# Altium project OpenRex_V1I1.PrjPcb (part 2 of 4)

## Sheet [05] - CPU - HDMI, LVDS.SchDoc
size A2; DocumentNumber: 5; SheetNumber: 5; SheetTotal: 31
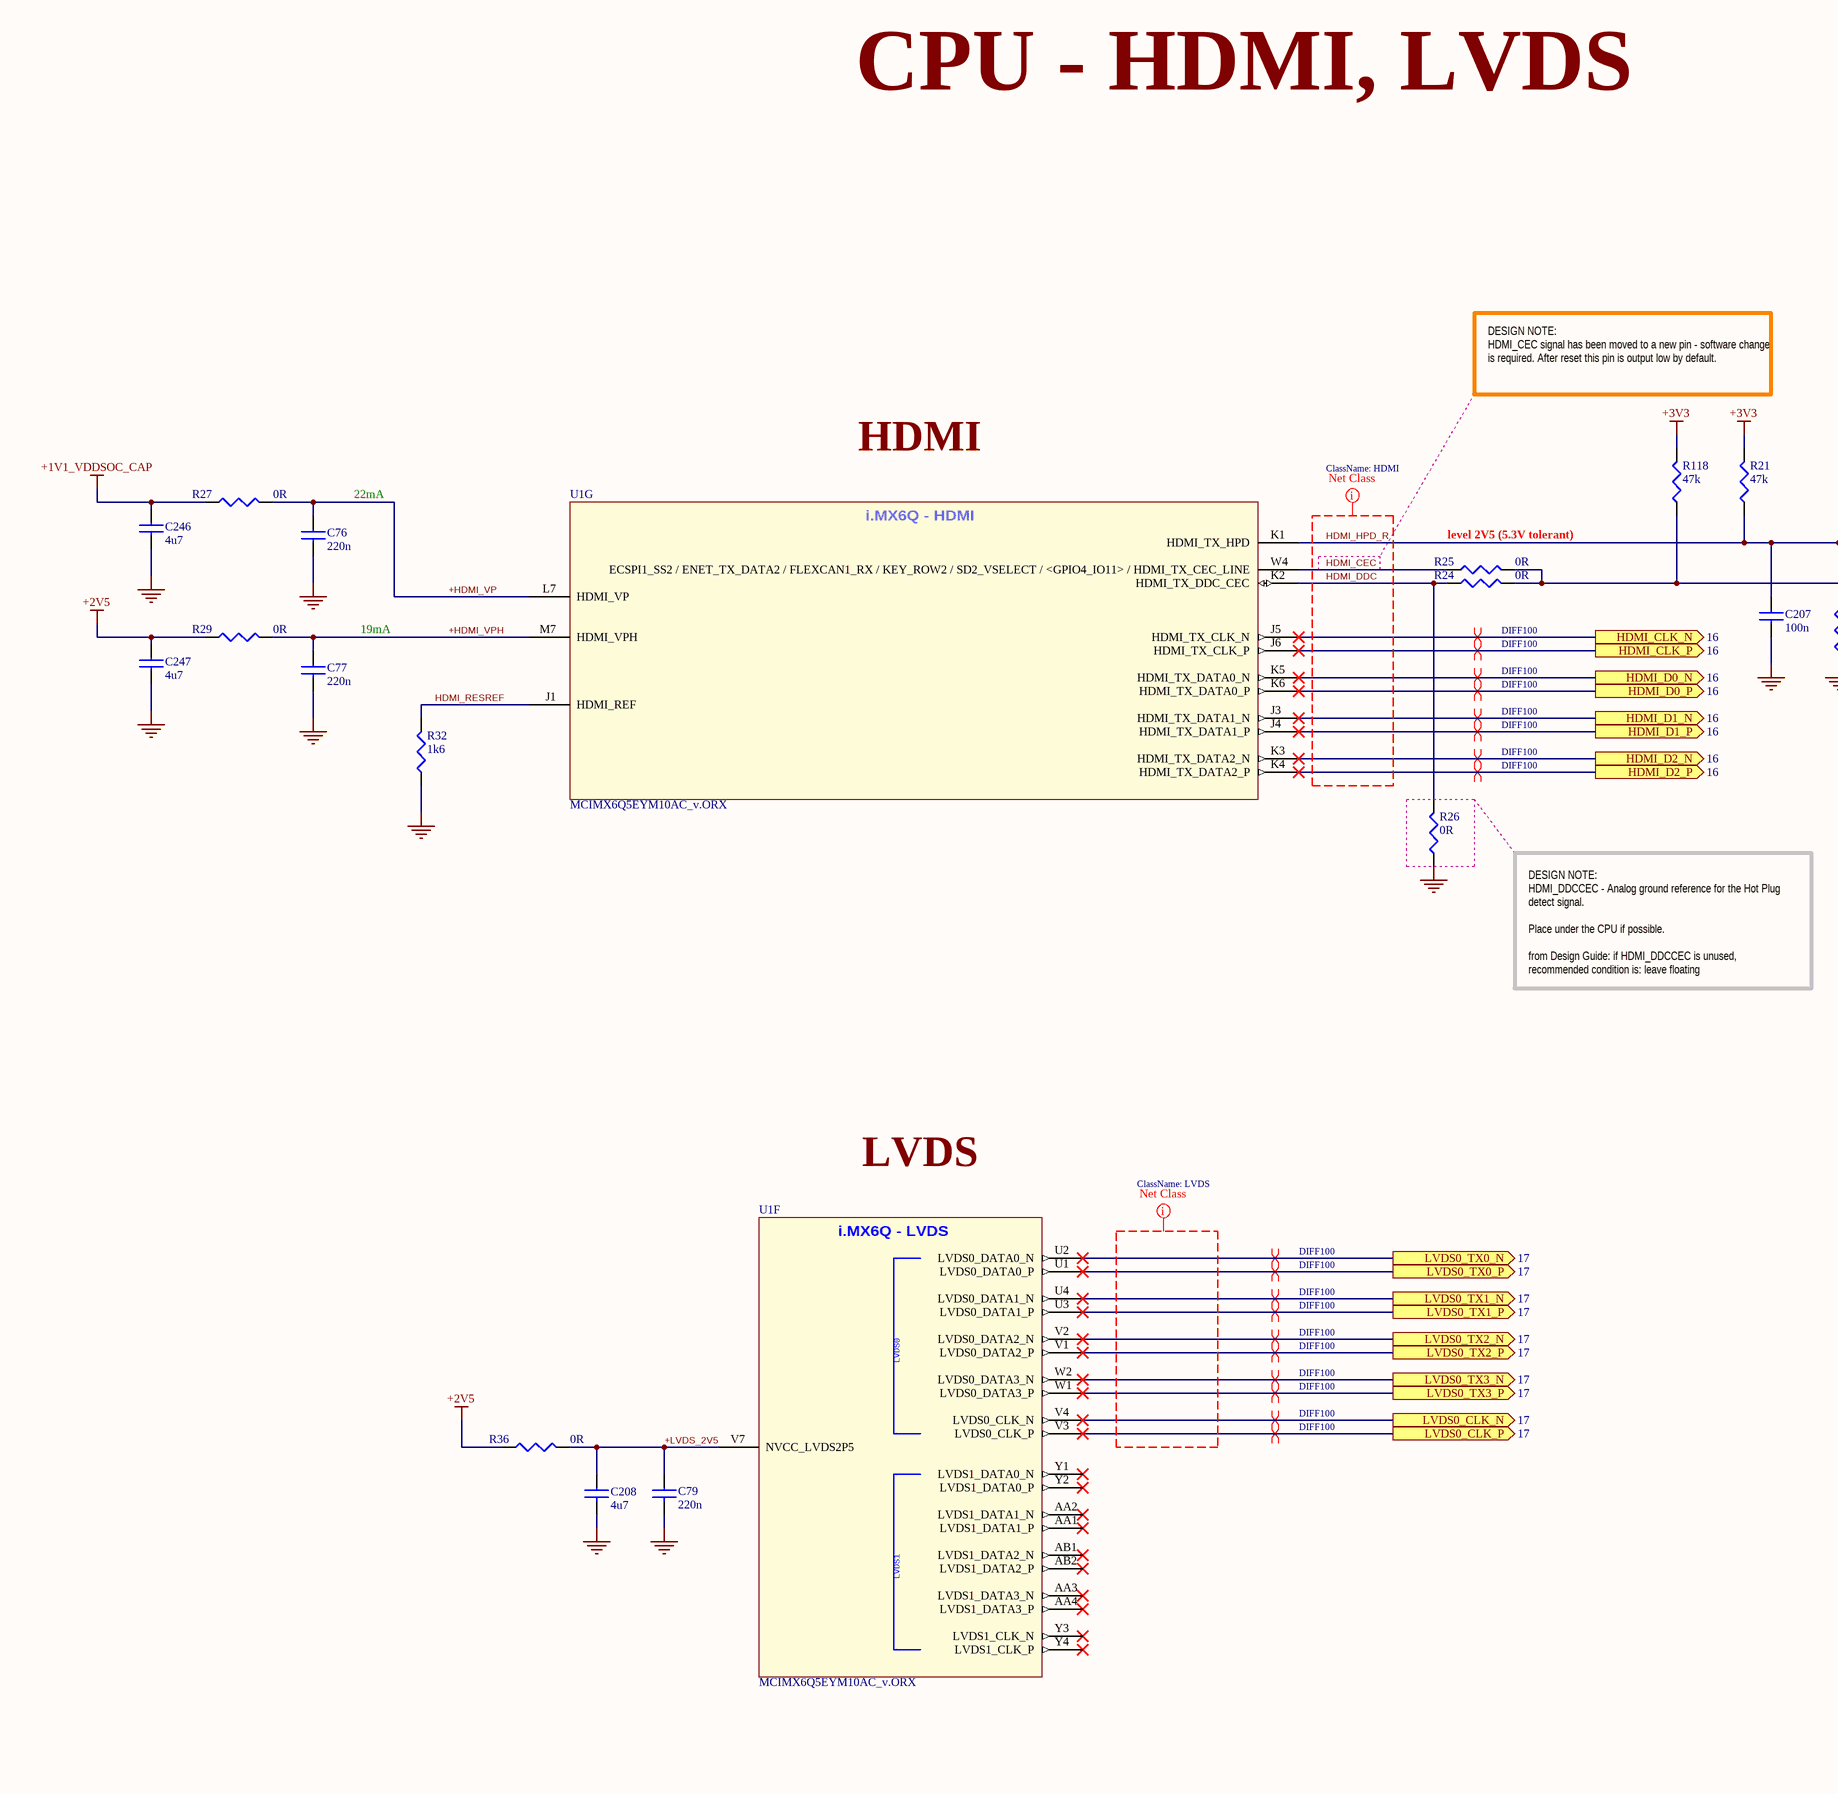
[diagram p5: [05] - CPU - HDMI, LVDS.SchDoc, left]
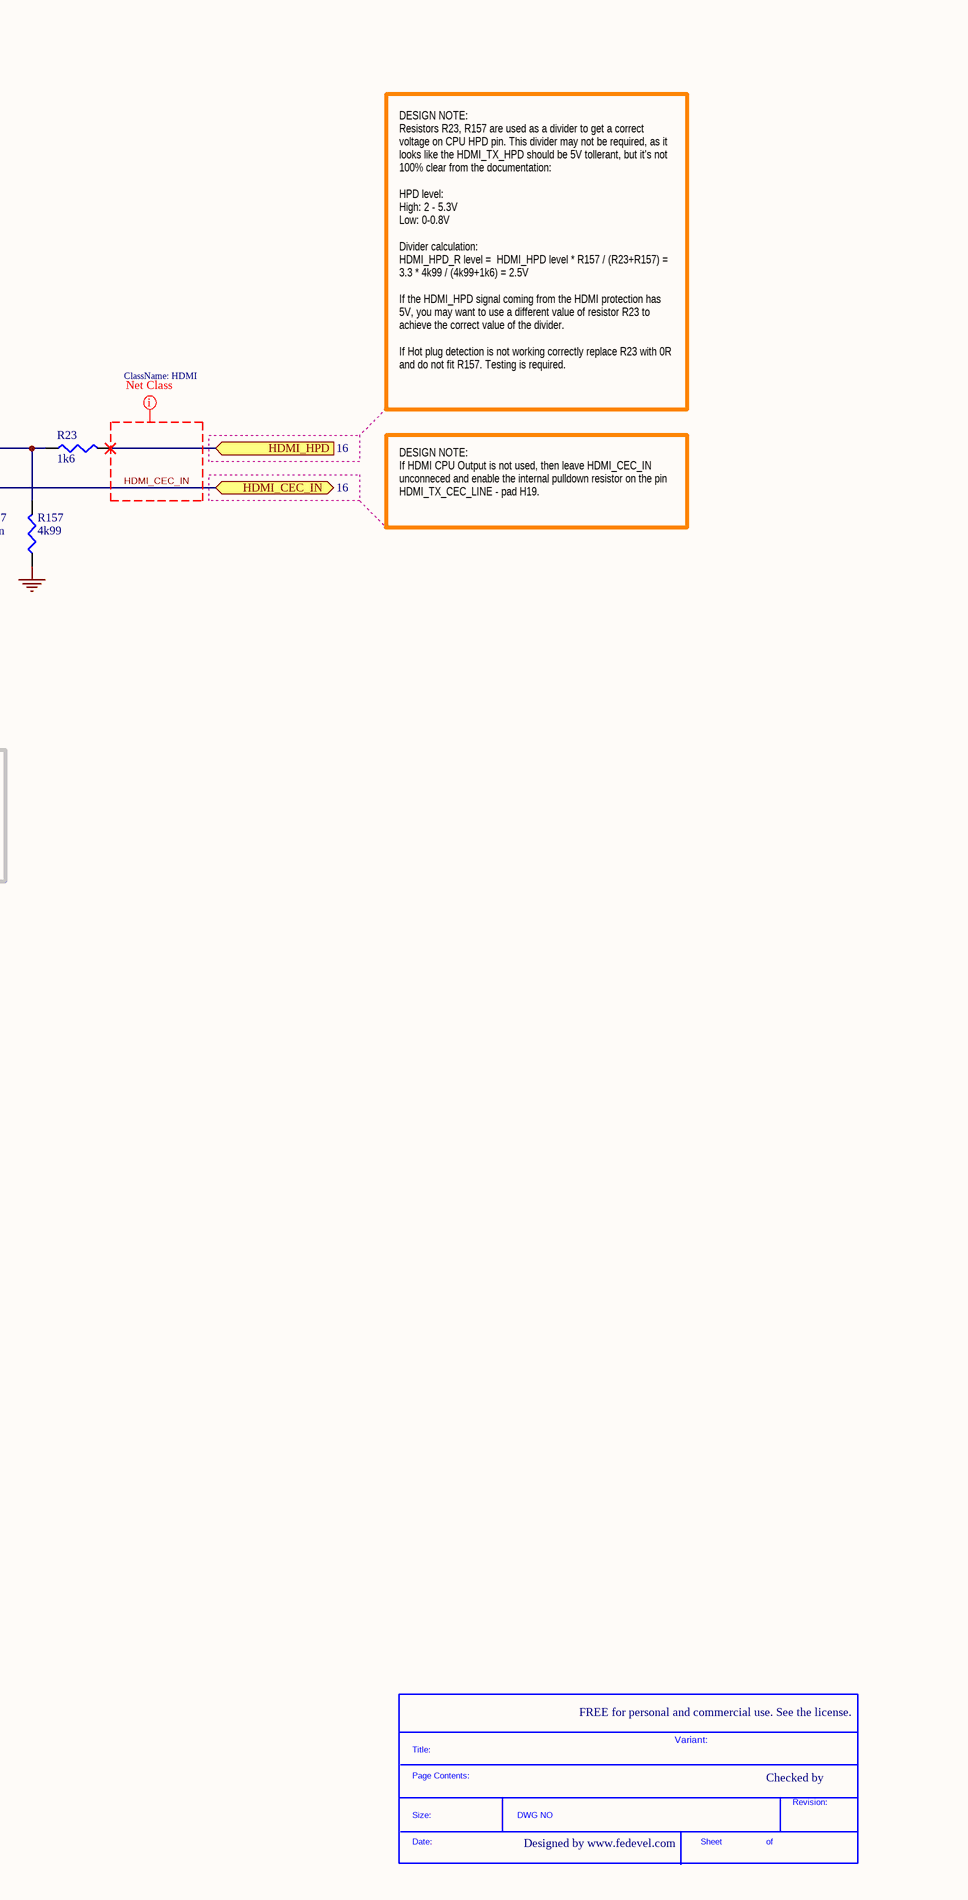
[diagram p6: [05] - CPU - HDMI, LVDS.SchDoc, right]

### Parts
(Parts that share a designator on the sheet are numbered #1, #2 ... from top to bottom, then left to right.)
*#4  SDTitleBlock  (value not drawn)  (graphical)
C76  220n  [C0201]
C77  220n  [C0201]
C79  220n  [C0201]
C207  100n  [C0402]
C208  4u7  [C0402]
C246  4u7  [C0402]
C247  4u7  [C0402]
R21  47k  [R0402]
R23  1k6  [R0402]
R24  0R  [R0402]
R25  0R  [R0402]
R26  0R  [R0402]
R27  0R  [R0402]
R29  0R  [R0402]
R32  1k6  [R0201]
R36  0R  [R0402]
R118  47k  [R0402]
R157  4k99  [R0402]
U1  MCIMX6Q5EYM10AC_v.ORX  [PBGA624]  (parts F,G of 21)

### Ports
HDMI_CEC_IN (bidir, see 16), HDMI_CLK_N (out, see 16), HDMI_CLK_P (out, see 16), HDMI_D0_N (out, see 16), HDMI_D0_P (out, see 16), HDMI_D1_N (out, see 16), HDMI_D1_P (out, see 16), HDMI_D2_N (out, see 16), HDMI_D2_P (out, see 16), HDMI_HPD (in, see 16), LVDS0_CLK_N (out, see 17), LVDS0_CLK_P (out, see 17), LVDS0_TX0_N (out, see 17), LVDS0_TX0_P (out, see 17), LVDS0_TX1_N (out, see 17), LVDS0_TX1_P (out, see 17), LVDS0_TX2_N (out, see 17), LVDS0_TX2_P (out, see 17), LVDS0_TX3_N (out, see 17), LVDS0_TX3_P (out, see 17)

### Nets
+1V1_VDDSOC_CAP: C246.1 R27.1
+2V5: C247.1 R29.1 R36.1
+3V3: R21.2 R118.2
GND: C76.2 C77.2 C79.2 C207.2 C208.2 C246.2 C247.2 R26.1 R32.1 R157.1
+HDMI_VP: C76.1 R27.2 U1.L7(HDMI_VP)
+HDMI_VPH: C77.1 R29.2 U1.M7(HDMI_VPH)
+LVDS_2V5: C79.1 C208.1 R36.2 U1.V7(NVCC_LVDS2P5)
HDMI_CEC: R25.1 U1.W4(ECSPI1_SS2_/_ENET_TX_DATA2_/_FLEXCAN1_RX_/_KEY_ROW2_/_SD2_VSELECT_/_<GPIO4_IO11>_/_HDMI_TX_CEC_LINE)
HDMI_CEC_IN: R24.2 R25.2 R118.1 ; port HDMI_CEC_IN
HDMI_CLK_N: U1.J5(HDMI_TX_CLK_N) ; port HDMI_CLK_N
HDMI_CLK_P: U1.J6(HDMI_TX_CLK_P) ; port HDMI_CLK_P
HDMI_D0_N: U1.K5(HDMI_TX_DATA0_N) ; port HDMI_D0_N
HDMI_D0_P: U1.K6(HDMI_TX_DATA0_P) ; port HDMI_D0_P
HDMI_D1_N: U1.J3(HDMI_TX_DATA1_N) ; port HDMI_D1_N
HDMI_D1_P: U1.J4(HDMI_TX_DATA1_P) ; port HDMI_D1_P
HDMI_D2_N: U1.K3(HDMI_TX_DATA2_N) ; port HDMI_D2_N
HDMI_D2_P: U1.K4(HDMI_TX_DATA2_P) ; port HDMI_D2_P
HDMI_DDC: R24.1 R26.2 U1.K2(HDMI_TX_DDC_CEC)
HDMI_HPD: R23.2 ; port HDMI_HPD
HDMI_HPD_R: C207.1 R21.1 R23.1 R157.2 U1.K1(HDMI_TX_HPD)
HDMI_RESREF: R32.2 U1.J1(HDMI_REF)
LVDS0_CLK_N: U1.V4(LVDS0_CLK_N) ; port LVDS0_CLK_N
LVDS0_CLK_P: U1.V3(LVDS0_CLK_P) ; port LVDS0_CLK_P
LVDS0_TX0_N: U1.U2(LVDS0_DATA0_N) ; port LVDS0_TX0_N
LVDS0_TX0_P: U1.U1(LVDS0_DATA0_P) ; port LVDS0_TX0_P
LVDS0_TX1_N: U1.U4(LVDS0_DATA1_N) ; port LVDS0_TX1_N
LVDS0_TX1_P: U1.U3(LVDS0_DATA1_P) ; port LVDS0_TX1_P
LVDS0_TX2_N: U1.V2(LVDS0_DATA2_N) ; port LVDS0_TX2_N
LVDS0_TX2_P: U1.V1(LVDS0_DATA2_P) ; port LVDS0_TX2_P
LVDS0_TX3_N: U1.W2(LVDS0_DATA3_N) ; port LVDS0_TX3_N
LVDS0_TX3_P: U1.W1(LVDS0_DATA3_P) ; port LVDS0_TX3_P

Not connected (* = marked no-connect by the designer): U1 AA1(LVDS1_DATA1_P)* AA2(LVDS1_DATA1_N)* AA3(LVDS1_DATA3_N)* AA4(LVDS1_DATA3_P)* AB1(LVDS1_DATA2_N)* AB2(LVDS1_DATA2_P)* Y1(LVDS1_DATA0_N)* Y2(LVDS1_DATA0_P)* Y3(LVDS1_CLK_N)* Y4(LVDS1_CLK_P)*

### Layout directives
differential pair; net class DIFF100: HDMI_CLK_N, HDMI_CLK_P, HDMI_D0_N, HDMI_D0_P, HDMI_D1_N, HDMI_D1_P, HDMI_D2_N, HDMI_D2_P, LVDS0_CLK_N, LVDS0_CLK_P, LVDS0_TX0_N, LVDS0_TX0_P, LVDS0_TX1_N, LVDS0_TX1_P, LVDS0_TX2_N, LVDS0_TX2_P, LVDS0_TX3_N, LVDS0_TX3_P
net class HDMI: HDMI_CEC, HDMI_CEC_IN, HDMI_DDC, HDMI_HPD_R
net class LVDS: (no net found under the mark)

### Notes on the sheet
- CPU - HDMI, LVDS
- DESIGN NOTE:
  HDMI_CEC signal has been moved to a new pin - software change is required. After reset this pin is output low by default.
- (near C76) 22mA
- HDMI
- DESIGN NOTE:
  Resistors R23, R157 are used as a divider to get a correct voltage on CPU HPD pin. This divider may not be required, as it looks like the HDMI_TX_HPD should be 5V tollerant, but it's not 100% clear from the documentation:
  HPD level:
  High: 2 - 5.3V
  Low: 0-0.8V
  Divider calculation:
  HDMI_HPD_R level =  HDMI_HPD level * R157 / (R23+R157) = 3.3 * 4k99 / (4k99+1k6) = 2.5V
  If the HDMI_HPD signal coming from the HDMI protection has 5V, you may want to use a different value of resistor R23 to achieve the correct value of the divider.
  If Hot plug detection is not working correctly replace R23 with 0R and do not fit R157. Testing is required.
- level 2V5 (5.3V tolerant)
- 19mA
- DESIGN NOTE:
  If HDMI CPU Output is not used, then leave HDMI_CEC_IN unconneced and enable the internal pulldown resistor on the pin HDMI_TX_CEC_LINE - pad H19.
- DESIGN NOTE:
  HDMI_DDCCEC - Analog ground reference for the Hot Plug detect signal.
  Place under the CPU if possible.
  from Design Guide: if HDMI_DDCCEC is unused, recommended condition is: leave floating
- LVDS
- FREE for personal and commercial use. See the license.
- Variant:
- Checked by
- Designed by www.fedevel.com
- (in symbol MCIMX6Q5EYM10AC_v.ORX, part F) i.MX6Q - LVDS; LVDS0; LVDS1
- (in symbol MCIMX6Q5EYM10AC_v.ORX, part G) i.MX6Q - HDMI
- (in symbol SDTitleBlock) Title:; Page Contents:; Revision:; Size:; DWG NO; Date:; Sheet; of

### Library data of the parts
C76 C77 C79 = C0603X5R0J224M030BB: CAP CER 0.22UF 6.3V 20% X5R 0201; Manufacturer: TDK Corporation; Capacitance: 0.22µF; .Checked PCB: MM; Supplier 1: Digi-Key; Manufacturer Part Number: C0603X5R0J224M030BB; RoHS: RoHS Compliant; Category: Capacitors; Stock 1: 205900; Pricing 1: 1=0.15, 10=0.102, 100=0.0485, 250=0.0408, 500=0.03418, 1000=0.0275, 5000=0.02325 (USD); Packaging: Cut Tape (CT); Tolerance: ±20%; Voltage - Rated: 6.3V; Temperature Coefficient: X5R; Mounting Type: Surface Mount, MLCC; Operating Temperature: -55°C ~ 85°C; Applications: General Purpose; Ratings: -; Package / Case: 0201 (0603 Metric); Size / Dimension: 0.024" L x 0.012" W (0.60mm x 0.30mm); Height - Seated (Max): -; Thickness (Max): 0.013" (0.33mm); Lead Spacing: -; Features: -; Lead Style: -; ComponentLink1URL: http://product.tdk.com/en/catalog/datasheets/mlcc_commercial_general_en.pdf; ComponentLink1Description: http://product.tdk.com/en/catalog/datasheets/mlcc_commercial_general_en.pdf; Supplier Part Number 1: 445-5929-1-ND; .Checked SCH: MM; .Creator: MM
C207 = C1005X5R1H104K: CAP CER .10UF 50V X5R 10% 0402; Manufacturer: TDK Corporation; Capacitance: 0.1µF; Value: 100nF; .Checked PCB: used; Category: Capacitors; Supplier Part Number: 445-5942-1-ND; Manufacturer Part Number: C1005X5R1H104K; Operating Temperature: -55°C ~ 85°C; Package / Case: 0402 (1005 Metric); Price 1k [$]: 0.02340; .Checked SCH: used; Voltage - Rated: 50V; Supplier: Digikey; Supplier 1: Digi-Key; Supplier Part Number 1: 445-5942-1-ND; RoHS: RoHS Compliant; Stock 1: 106926; Pricing 1: 1=0.27, 10=0.18, 100=0.072, 250=0.05176, 500=0.0369, 1000=0.027 (USD); Tolerance: ±10%; Temperature Coefficient: X5R; Mounting Type: Surface Mount, MLCC; Applications: General Purpose; Ratings: -; Size / Dimension: 0.039" L x 0.020" W (1.00mm x 0.50mm); Height - Seated (Max): -; Thickness (Max): 0.022" (0.55mm); Lead Spacing: -; Features: -; Packaging: Cut Tape (CT); Lead Style: -; ComponentLink1URL: http://www.tdk.co.jp/tefe02/e412_c.pdf; ComponentLink1Description: http://www.tdk.co.jp/tefe02/e412_c.pdf
C208 C246 C247 = C1005X5R1A475M: CAP CER 4.7UF 10V 20% X5R 0402; Manufacturer: TDK Corporation; Capacitance: 4.7µF; .Checked PCB: used; Supplier 1: Digi-Key; Supplier Part Number 1: 445-8023-1-ND; Manufacturer Part Number: C1005X5R1A475M; RoHS: RoHS Compliant; Category: Capacitors; Stock 1: 10140; Pricing 1: 1=0.53, 10=0.415, 100=0.25, 250=0.18752, 500=0.16, 1000=0.125, 5000=0.095 (USD); Voltage - Rated: 10V; Tolerance: ±20%; Temperature Coefficient: X5R; Mounting Type: Surface Mount, MLCC; Operating Temperature: -55°C ~ 85°C; Applications: General Purpose; Ratings: -; Package / Case: 0402 (1005 Metric); Size / Dimension: 0.039" L x 0.020" W (1.00mm x 0.50mm); Height - Seated (Max): -; Thickness (Max): -; Lead Spacing: -; Features: -; Packaging: Cut Tape (CT); Lead Style: -; ComponentLink1URL: http://www.tdk.com/pdf/general_B11.pdf; ComponentLink1Description: http://www.tdk.com/pdf/general_B11.pdf; .Checked SCH: used
R21 R118 = RC0402FR-0747KL: RES 47.0K OHM 1/16W 1% 0402 SMD; Manufacturer: Yageo; Power (Watts): 0.063W, 1/16W; .Checked PCB: used; Temperature Coefficient: ±100ppm/°C; Category: Resistors; Supplier Part Number: 311-47.0KLRCT-ND; Manufacturer Part Number: RC0402FR-0747KL; Package / Case: 0402 (1005 Metric); Price 1k [$]: 0.01421; Resistance (Ohms): 47K; Tolerance: ±1%; Value: 47k; .Checked SCH: used; Supplier: Digikey; Supplier 1: Digi-Key; Supplier Part Number 1: 311-47.0KLRCT-ND; RoHS: RoHS Compliant; Stock 1: 1227580; Pricing 1: 10=0.014, 50=0.0104, 100=0.0079, 250=0.00584, 500=0.00432, 1000=0.00288 (USD); Composition: Thick Film; Features: -; Size / Dimension: 0.039" L x 0.020" W (1.00mm x 0.50mm); Height: 0.016" (0.40mm); Number of Terminations: 2; Packaging: Cut Tape (CT); ComponentLink1URL: http://www.yageo.com/documents/recent/PYu-RC0402_51_RoHS_L_6.pdf; ComponentLink1Description: http://www.yageo.com/documents/recent/PYu-RC0402_51_RoHS_L_6.pdf
R23 = ERJ-2RKF1601X: RES 1.6K OHM 1/10W 1% 0402 SMD; Manufacturer: Panasonic Electronic Components; Power (Watts): 0.1W, 1/10W; Temperature Coefficient: ±100ppm/°C; .Creator: MM; .Checked PCB: used; Supplier 1: Digi-Key; Manufacturer Part Number: ERJ-2RKF1601X; RoHS: RoHS Compliant; Category: Resistors; Stock 1: 89488; Pricing 1: 1=0.1, 50=0.0242, 100=0.0184, 250=0.01364, 500=0.01008, 1000=0.00672, 5000=0.00473 (USD); Resistance (Ohms): 1.6k; Composition: Thick Film; Features: -; Tolerance: ±1%; Package / Case: 0402 (1005 Metric); Supplier Device Package: 0402; Size / Dimension: 0.039" L x 0.020" W (1.00mm x 0.50mm); Height: 0.016" (0.40mm); Number of Terminations: 2; Packaging: Cut Tape (CT); ComponentLink1URL: http://industrial.panasonic.com/www-cgi/jvcr13pz.cgi?E+PZ+3+AOA0002+ERJ2RKF1601X+7+WW; ComponentLink1Description: http://industrial.panasonic.com/www-cgi/jvcr13pz.cgi?E+PZ+3+AOA0002+ERJ2RKF1601X+7+WW; Supplier Part Number 1: P1.60KLCT-ND; .Checked SCH: used
R24-R27 R29 R36 = RC0402JR-070RL: RES 0.0 OHM 1/16W 0402 SMD; Manufacturer: Yageo; Resistance (Ohms): 0.0; Power (Watts): 0.063W, 1/16W; Tolerance: Jumper; .Checked PCB: used; Category: Resistors; Supplier Part Number: 311-0.0JRCT-ND; Manufacturer Part Number: RC0402JR-070RL; Package / Case: 0402 (1005 Metric); Price 1k [$]: 0.01389; Value: 0R; .Checked SCH: used; Supplier: Digikey; Supplier 1: Digi-Key; Supplier Part Number 1: 311-0.0JRCT-ND; RoHS: RoHS Compliant; Stock 1: 1106330; Pricing 1: 10=0.012, 50=0.009, 100=0.0069, 250=0.00512, 500=0.0038, 1000=0.00253 (USD); Composition: Thick Film; Features: -; Temperature Coefficient: -; Size / Dimension: 0.039" L x 0.020" W (1.00mm x 0.50mm); Height: 0.016" (0.40mm); Number of Terminations: 2; Packaging: Cut Tape (CT); ComponentLink1URL: http://www.yageo.com/documents/recent/PYu-RC0402_51_RoHS_L_6.pdf; ComponentLink1Description: http://www.yageo.com/documents/recent/PYu-RC0402_51_RoHS_L_6.pdf
R32 = CRCW02011K60FKED: RES 1.60K OHM 1/20W 1% 0201 SMD; Manufacturer: Vishay Dale; Resistance (Ohms): 1.6k; Power (Watts): 0.05W, 1/20W; Temperature Coefficient: ±100ppm/°C; .Creator: MM; Supplier 1: Digi-Key; Manufacturer Part Number: CRCW02011K60FKED; RoHS: RoHS Compliant; Category: Resistors; Stock 1: 31501; Pricing 1: 1=0.26, 10=0.218, 25=0.1584, 50=0.1148, 100=0.0851, 250=0.06536, 500=0.05148, 1000=0.03564, 2500=0.03267 (USD); Packaging: Cut Tape (CT); Tolerance: ±1%; Composition: Thick Film; Features: -; Package / Case: 0201 (0603 Metric); Supplier Device Package: 0201 (0603 Metric); Size / Dimension: 0.024" L x 0.012" W (0.60mm x 0.30mm); Height: 0.011" (0.28mm); Number of Terminations: 2; ComponentLink1URL: http://www.vishay.com/docs/20052/crcw0201e3.pdf; ComponentLink1Description: http://www.vishay.com/docs/20052/crcw0201e3.pdf; Supplier Part Number 1: 541-1.60KAABCT-ND; .Checked PCB: MM; .Checked SCH: MM
R157 = RMCF0402FT4K99: RES TF 4.99K OHM 1% 1/16W 0402; Manufacturer: Stackpole Electronics Inc; Power (Watts): 0.063W, 1/16W; .Checked PCB: used; Temperature Coefficient: ±100ppm/°C; Category: Resistors; Supplier Part Number: RMCF0402FT4K99CT-ND; Manufacturer Part Number: RMCF0402FT4K99; Package / Case: 0402 (1005 Metric); Price 1k [$]: 0.00384; Resistance (Ohms): 4.99K; Tolerance: ±1%; Value: 4k99; .Checked SCH: used; Supplier: Digikey; Supplier 1: Digi-Key; Supplier Part Number 1: RMCF0402FT4K99CT-ND; RoHS: RoHS Compliant; Stock 1: 48509; Pricing 1: 1=0.04, 10=0.025, 50=0.0138, 100=0.0105, 250=0.0078, 500=0.00576, 1000=0.00384 (USD); Composition: Thick Film; Features: -; Size / Dimension: 0.039" L x 0.020" W (1.00mm x 0.50mm); Height: 0.016" (0.40mm); Number of Terminations: 2; Packaging: Cut Tape (CT); ComponentLink1URL: http://www.seielect.com/Catalog/SEI-RMCF.pdf; ComponentLink1Description: http://www.seielect.com/Catalog/SEI-RMCF.pdf
U1 = MCIMX6Q5EYM10AC_v.ORX: IC MCU 32BIT ARM QUAD 624FCBGA; Manufacturer: Freescale Semiconductor; Speed: 1.0GHz; .Creator: MM; .Checked PCB: MM, checked by RF; Core Processor: ARM® Cortex™-A9; Core Size: 32-Bit Quad-Core; Connectivity: CAN, EBI/EMI, ESAI, Ethernet, GPMI, I2C, MMC/SD, PCI, SATA, SPI, UART, USB, USB OTG; Peripherals: DMA, HDMI, I2S/SSI/AC97, MIPI CSI, MIMI DSI, MIPI HIS, PWM, WDT; Number of I /O: 224; Program Memory Type: External Program Memory; RAM Size: 256K x 8; Voltage - Supply (Vcc/Vdd): 0.925 V ~ 1.5 V; Oscillator Type: Internal; Supplier 1: Digi-Key; Manufacturer Part Number: MCIMX6Q5EYM10AC; RoHS: RoHS Compliant; Category: Integrated Circuits (ICs); Stock 1: 0; Pricing 1: 1=54.98, 10=51.922, 25=48.868, 100=30.5424 (USD); Packaging: Tray; Package / Case: 624-FBGA, FCBGA; ComponentLink1URL: http://cache.freescale.com/files/32bit/doc/data_sheet/IMX6DQCEC.pdf; ComponentLink1Description: http://cache.freescale.com/files/32bit/doc/data_sheet/IMX6DQCEC.pdf; Supplier Part Number 1: MCIMX6Q5EYM10AC-ND; Program Memory Size: -; EEPROM Size: -; Data Converters: -; Operating Temperature: -20°C ~ 105°C

## Sheet [06] - CPU - ETHERNET, SATA.SchDoc
size A2; DocumentNumber: 6; SheetNumber: 6; SheetTotal: 31
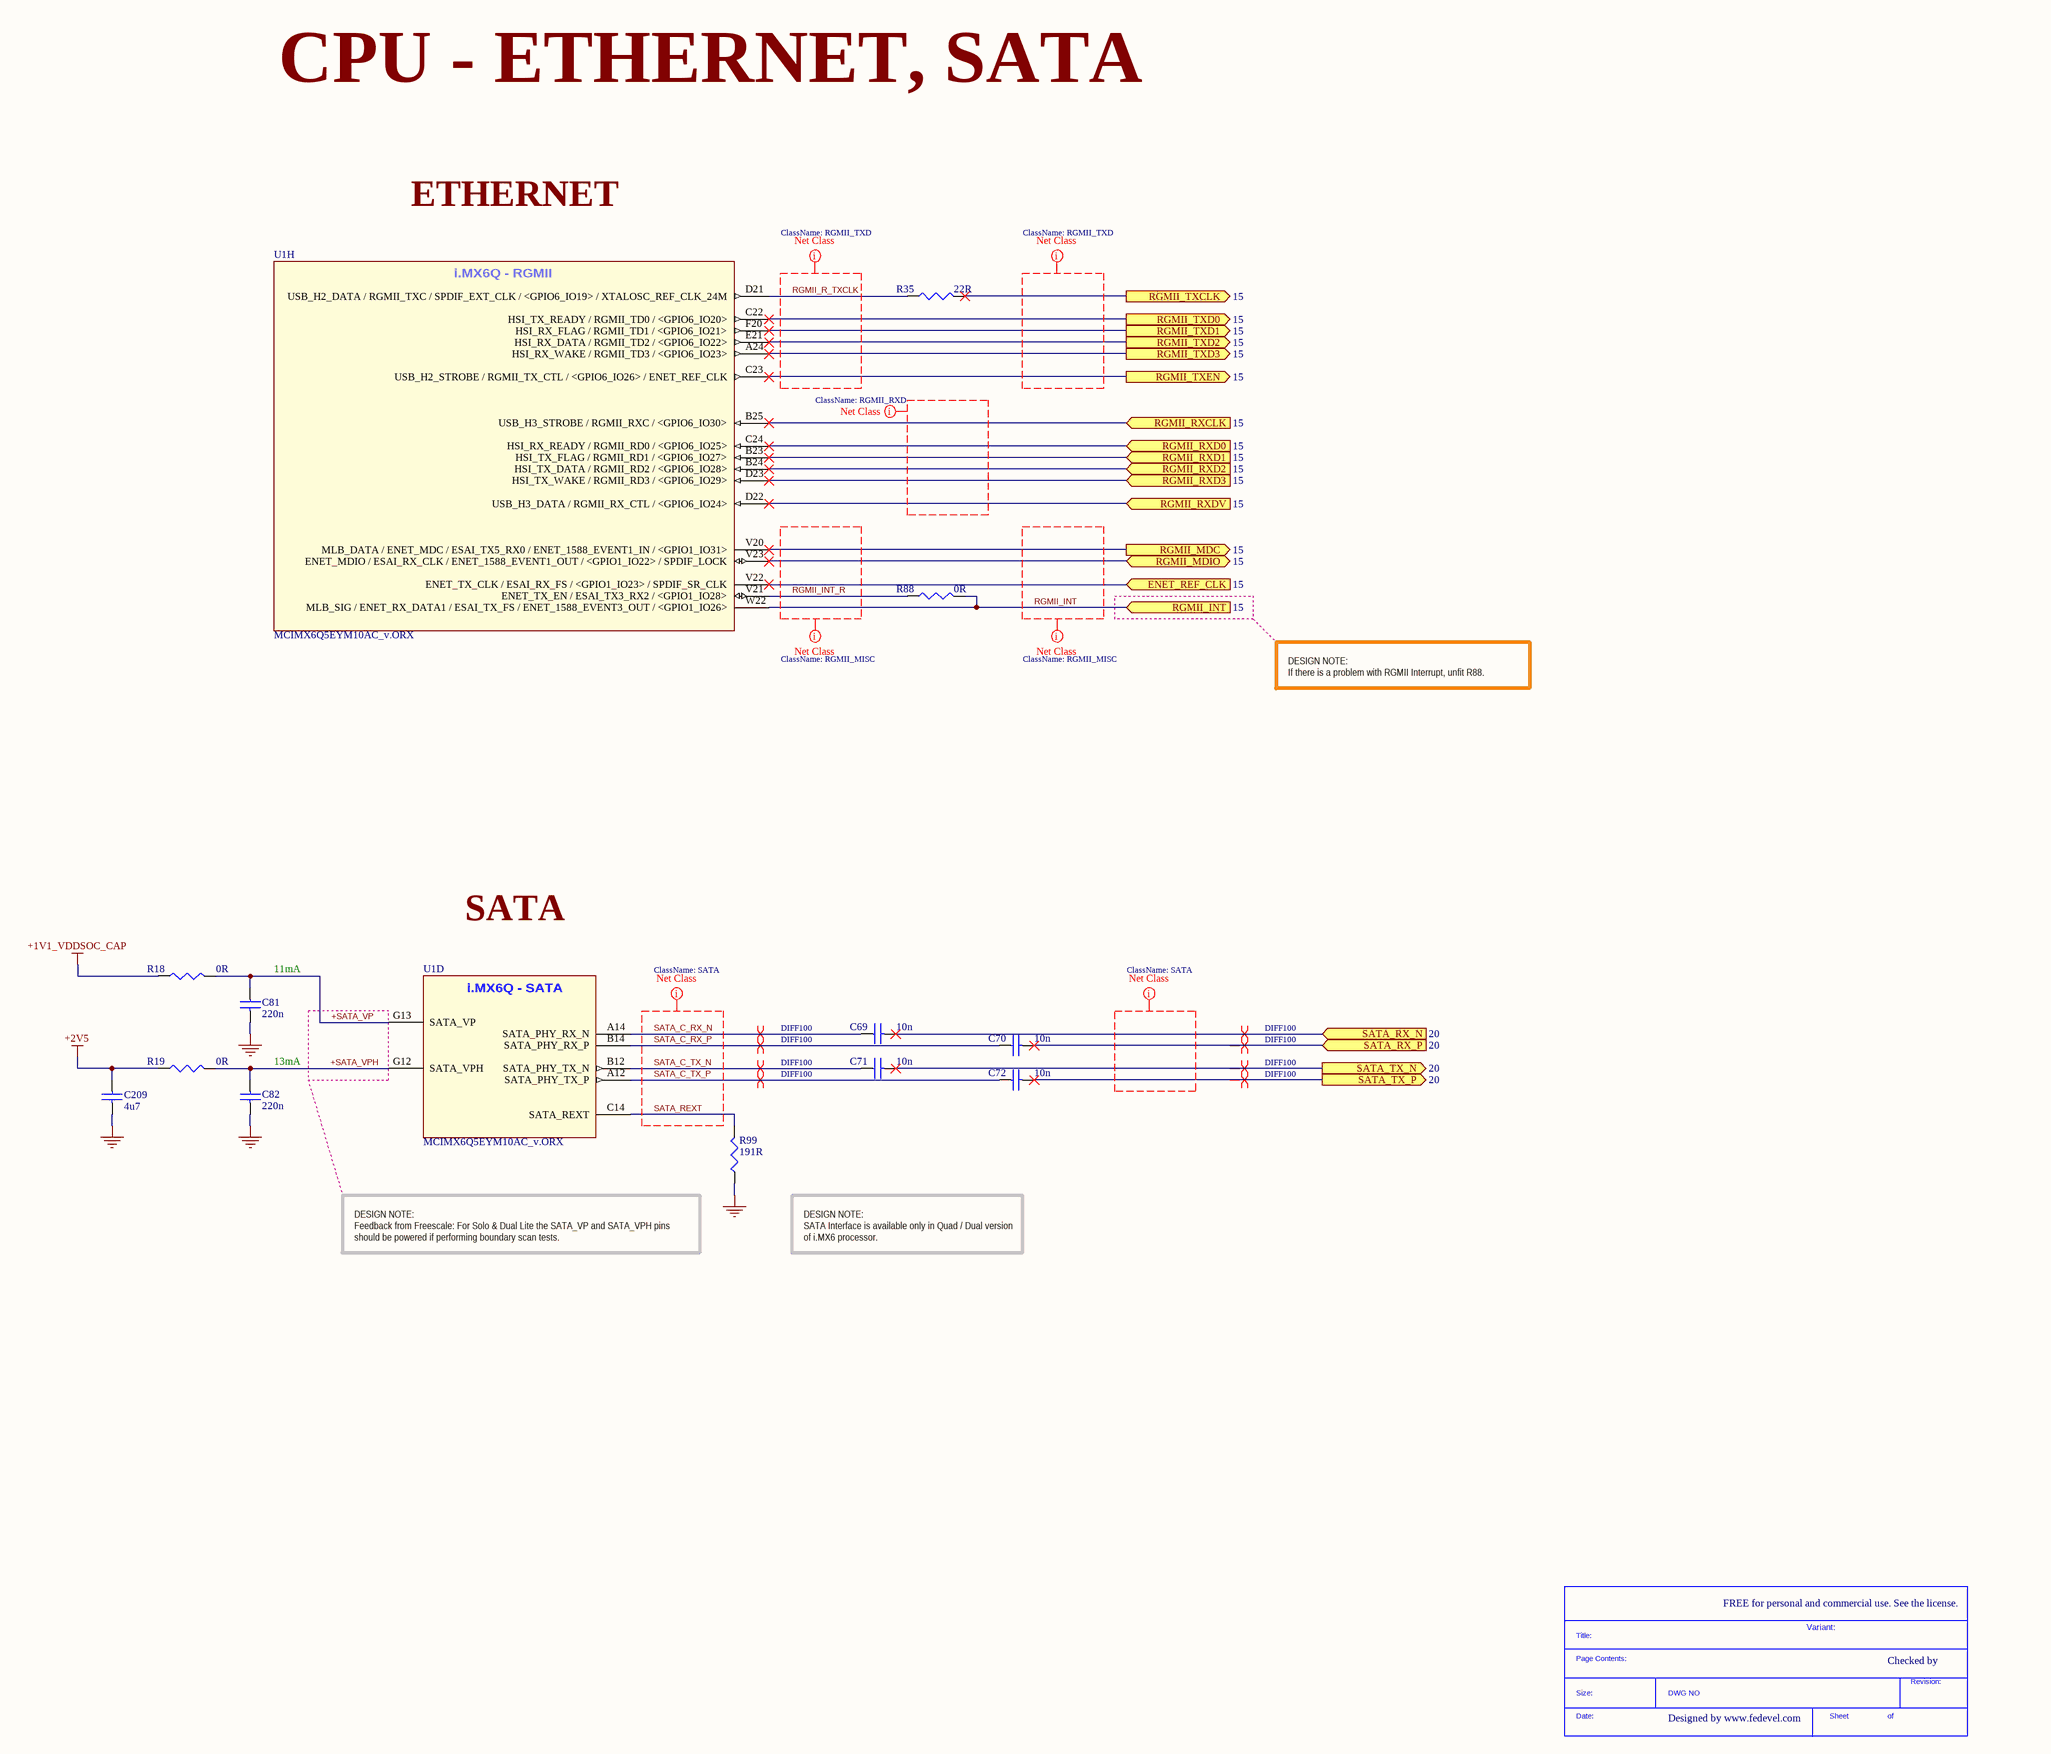
[diagram p7: [06] - CPU - ETHERNET, SATA.SchDoc]

### Parts
(Parts that share a designator on the sheet are numbered #1, #2 ... from top to bottom, then left to right.)
*#5  SDTitleBlock  (value not drawn)  (graphical)
C69  10n  [C0402]
C70  10n  [C0402]
C71  10n  [C0402]
C72  10n  [C0402]
C81  220n  [C0201]
C82  220n  [C0201]
C209  4u7  [C0402]
R18  0R  [R0402]
R19  0R  [R0402]
R35  22R  [R0402]
R88  0R  [R0402]
R99  191R  [R0201]
U1  MCIMX6Q5EYM10AC_v.ORX  [PBGA624]  (parts D,H of 21)

### Ports
ENET_REF_CLK (in, see 15), RGMII_INT (in, see 15), RGMII_MDC (out, see 15), RGMII_MDIO (bidir, see 15), RGMII_RXCLK (in, see 15), RGMII_RXD0 (in, see 15), RGMII_RXD1 (in, see 15), RGMII_RXD2 (in, see 15), RGMII_RXD3 (in, see 15), RGMII_RXDV (in, see 15), RGMII_TXCLK (out, see 15), RGMII_TXD0 (out, see 15), RGMII_TXD1 (out, see 15), RGMII_TXD2 (out, see 15), RGMII_TXD3 (out, see 15), RGMII_TXEN (out, see 15), SATA_RX_N (in, see 20), SATA_RX_P (in, see 20), SATA_TX_N (out, see 20), SATA_TX_P (out, see 20)

### Nets
+1V1_VDDSOC_CAP: R18.1
+2V5: C209.1 R19.1
GND: C81.2 C82.2 C209.2 R99.1
+SATA_VP: C81.1 R18.2 U1.G13(SATA_VP)
+SATA_VPH: C82.1 R19.2 U1.G12(SATA_VPH)
ENET_REF_CLK: U1.V22(ENET_TX_CLK_/_ESAI_RX_FS_/_<GPIO1_IO23>_/_SPDIF_SR_CLK) ; port ENET_REF_CLK
RGMII_INT: R88.2 U1.W22(MLB_SIG_/_ENET_RX_DATA1_/_ESAI_TX_FS_/_ENET_1588_EVENT3_OUT_/_<GPIO1_IO26>) ; port RGMII_INT
RGMII_INT_R: R88.1 U1.V21(ENET_TX_EN_/_ESAI_TX3_RX2_/_<GPIO1_IO28>)
RGMII_MDC: U1.V20(MLB_DATA_/_ENET_MDC_/_ESAI_TX5_RX0_/_ENET_1588_EVENT1_IN_/_<GPIO1_IO31>) ; port RGMII_MDC
RGMII_MDIO: U1.V23(ENET_MDIO_/_ESAI_RX_CLK_/_ENET_1588_EVENT1_OUT_/_<GPIO1_IO22>_/_SPDIF_LOCK) ; port RGMII_MDIO
RGMII_R_TXCLK: R35.1 U1.D21(USB_H2_DATA_/_RGMII_TXC_/_SPDIF_EXT_CLK_/_<GPIO6_IO19>_/_XTALOSC_REF_CLK_24M)
RGMII_RXCLK: U1.B25(USB_H3_STROBE_/_RGMII_RXC_/_<GPIO6_IO30>) ; port RGMII_RXCLK
RGMII_RXD0: U1.C24(HSI_RX_READY_/_RGMII_RD0_/_<GPIO6_IO25>) ; port RGMII_RXD0
RGMII_RXD1: U1.B23(HSI_TX_FLAG_/_RGMII_RD1_/_<GPIO6_IO27>) ; port RGMII_RXD1
RGMII_RXD2: U1.B24(HSI_TX_DATA_/_RGMII_RD2_/_<GPIO6_IO28>) ; port RGMII_RXD2
RGMII_RXD3: U1.D23(HSI_TX_WAKE_/_RGMII_RD3_/_<GPIO6_IO29>) ; port RGMII_RXD3
RGMII_RXDV: U1.D22(USB_H3_DATA_/_RGMII_RX_CTL_/_<GPIO6_IO24>) ; port RGMII_RXDV
RGMII_TXCLK: R35.2 ; port RGMII_TXCLK
RGMII_TXD0: U1.C22(HSI_TX_READY_/_RGMII_TD0_/_<GPIO6_IO20>) ; port RGMII_TXD0
RGMII_TXD1: U1.F20(HSI_RX_FLAG_/_RGMII_TD1_/_<GPIO6_IO21>) ; port RGMII_TXD1
RGMII_TXD2: U1.E21(HSI_RX_DATA_/_RGMII_TD2_/_<GPIO6_IO22>) ; port RGMII_TXD2
RGMII_TXD3: U1.A24(HSI_RX_WAKE_/_RGMII_TD3_/_<GPIO6_IO23>) ; port RGMII_TXD3
RGMII_TXEN: U1.C23(USB_H2_STROBE_/_RGMII_TX_CTL_/_<GPIO6_IO26>_/_ENET_REF_CLK) ; port RGMII_TXEN
SATA_C_RX_N: C69.1 U1.A14(SATA_PHY_RX_N)
SATA_C_RX_P: C70.1 U1.B14(SATA_PHY_RX_P)
SATA_C_TX_N: C71.1 U1.B12(SATA_PHY_TX_N)
SATA_C_TX_P: C72.1 U1.A12(SATA_PHY_TX_P)
SATA_REXT: R99.2 U1.C14(SATA_REXT)
SATA_RX_N: C69.2 ; port SATA_RX_N
SATA_RX_P: C70.2 ; port SATA_RX_P
SATA_TX_N: C71.2 ; port SATA_TX_N
SATA_TX_P: C72.2 ; port SATA_TX_P

### Layout directives
net class RGMII_MISC: RGMII_INT, RGMII_INT_R
net class RGMII_TXD: (no net found under the mark), RGMII_R_TXCLK
net class RGMII_RXD: (no net found under the mark)
differential pair; net class DIFF100: SATA_C_RX_N, SATA_C_RX_P, SATA_C_TX_N, SATA_C_TX_P, SATA_RX_N, SATA_RX_P, SATA_TX_N, SATA_TX_P
net class SATA: (no net found under the mark), SATA_C_RX_N, SATA_C_RX_P, SATA_C_TX_N, SATA_C_TX_P, SATA_REXT

### Notes on the sheet
- CPU - ETHERNET, SATA
- ETHERNET
- DESIGN NOTE:
  If there is a problem with RGMII Interrupt, unfit R88.
- SATA
- (near C81) 11mA
- 13mA
- DESIGN NOTE:
  Feedback from Freescale: For Solo & Dual Lite the SATA_VP and SATA_VPH pins should be powered if performing boundary scan tests.
- DESIGN NOTE:
  SATA Interface is available only in Quad / Dual version of i.MX6 processor.
- FREE for personal and commercial use. See the license.
- Variant:
- Checked by
- Designed by www.fedevel.com
- (in symbol MCIMX6Q5EYM10AC_v.ORX, part D) i.MX6Q - SATA
- (in symbol MCIMX6Q5EYM10AC_v.ORX, part H) i.MX6Q - RGMII
- (in symbol SDTitleBlock) Title:; Page Contents:; Revision:; Size:; DWG NO; Date:; Sheet; of

### Library data of the parts
C69-C72 = C1005X7R1H103K: CAP CER 10000PF 50V 10% X7R 0402; Manufacturer: TDK Corporation; Value: 10nF; .Checked PCB: used; Capacitance: 10000pF; Category: Capacitors; Supplier Part Number: 445-6850-1-ND; Manufacturer Part Number: C1005X7R1H103K; Operating Temperature: -55°C ~ 125°C; Package / Case: 0402 (1005 Metric); Price 1k [$]: 0.01625; .Checked SCH: used; Voltage - Rated: 50V; Supplier: Digikey; Supplier 1: Digi-Key; Supplier Part Number 1: 445-6850-1-ND; RoHS: RoHS Compliant; Stock 1: 3901; Pricing 1: 1=0.2, 10=0.125, 100=0.045, 250=0.03252, 500=0.024, 1000=0.01625 (USD); Tolerance: ±10%; Temperature Coefficient: X7R; Mounting Type: Surface Mount, MLCC; Applications: General Purpose; Ratings: -; Size / Dimension: 0.039" L x 0.020" W (1.00mm x 0.50mm); Height - Seated (Max): -; Thickness (Max): 0.022" (0.55mm); Lead Spacing: -; Features: -; Packaging: Cut Tape (CT); Lead Style: -; ComponentLink1URL: http://www.tdk.co.jp/tefe02/e412_c.pdf; ComponentLink1Description: http://www.tdk.co.jp/tefe02/e412_c.pdf
C81 C82 = C0603X5R0J224M030BB: as C76 on sheet [05] - CPU - HDMI, LVDS; Supplier 1: Digi-Key; Manufacturer Part Number: C0603X5R0J224M030BB; RoHS: RoHS Compliant; Category: Capacitors; Stock 1: 205900; Pricing 1: 1=0.15, 10=0.102, 100=0.0485, 250=0.0408, 500=0.03418, 1000=0.0275, 5000=0.02325 (USD); Packaging: Cut Tape (CT); Tolerance: ±20%; Voltage - Rated: 6.3V; Temperature Coefficient: X5R; Mounting Type: Surface Mount, MLCC; Operating Temperature: -55°C ~ 85°C; Applications: General Purpose; Ratings: -; Package / Case: 0201 (0603 Metric); Size / Dimension: 0.024" L x 0.012" W (0.60mm x 0.30mm); Height - Seated (Max): -; Thickness (Max): 0.013" (0.33mm); Lead Spacing: -; Features: -; Lead Style: -; ComponentLink1URL: http://product.tdk.com/en/catalog/datasheets/mlcc_commercial_general_en.pdf; ComponentLink1Description: http://product.tdk.com/en/catalog/datasheets/mlcc_commercial_general_en.pdf; Supplier Part Number 1: 445-5929-1-ND; .Checked SCH: MM; .Creator: MM
C209 = C1005X5R1A475M: as C208 on sheet [05] - CPU - HDMI, LVDS; Supplier 1: Digi-Key; Supplier Part Number 1: 445-8023-1-ND; Manufacturer Part Number: C1005X5R1A475M; RoHS: RoHS Compliant; Category: Capacitors; Stock 1: 10140; Pricing 1: 1=0.53, 10=0.415, 100=0.25, 250=0.18752, 500=0.16, 1000=0.125, 5000=0.095 (USD); Voltage - Rated: 10V; Tolerance: ±20%; Temperature Coefficient: X5R; Mounting Type: Surface Mount, MLCC; Operating Temperature: -55°C ~ 85°C; Applications: General Purpose; Ratings: -; Package / Case: 0402 (1005 Metric); Size / Dimension: 0.039" L x 0.020" W (1.00mm x 0.50mm); Height - Seated (Max): -; Thickness (Max): -; Lead Spacing: -; Features: -; Packaging: Cut Tape (CT); Lead Style: -; ComponentLink1URL: http://www.tdk.com/pdf/general_B11.pdf; ComponentLink1Description: http://www.tdk.com/pdf/general_B11.pdf; .Checked SCH: used
R18 R19 R88 = RC0402JR-070RL: as R24 on sheet [05] - CPU - HDMI, LVDS; Category: Resistors; Supplier Part Number: 311-0.0JRCT-ND; Manufacturer Part Number: RC0402JR-070RL; Package / Case: 0402 (1005 Metric); Price 1k [$]: 0.01389; Value: 0R; .Checked SCH: used; Supplier: Digikey; Supplier 1: Digi-Key; Supplier Part Number 1: 311-0.0JRCT-ND; RoHS: RoHS Compliant; Stock 1: 1106330; Pricing 1: 10=0.012, 50=0.009, 100=0.0069, 250=0.00512, 500=0.0038, 1000=0.00253 (USD); Composition: Thick Film; Features: -; Temperature Coefficient: -; Size / Dimension: 0.039" L x 0.020" W (1.00mm x 0.50mm); Height: 0.016" (0.40mm); Number of Terminations: 2; Packaging: Cut Tape (CT); ComponentLink1URL: http://www.yageo.com/documents/recent/PYu-RC0402_51_RoHS_L_6.pdf; ComponentLink1Description: http://www.yageo.com/documents/recent/PYu-RC0402_51_RoHS_L_6.pdf
R35 = RC0402FR-0722RL: RES 22.0 OHM 1/16W 1% 0402 SMD; Manufacturer: Yageo; Resistance (Ohms): 22; Power (Watts): 0.063W, 1/16W; .Checked PCB: used; Temperature Coefficient: ±100ppm/°C; Category: Resistors; Supplier Part Number: 311-22.0LRCT-ND; Manufacturer Part Number: RC0402FR-0722RL; Package / Case: 0402 (1005 Metric); Price 1k [$]: 0.01421; Tolerance: ±1%; Value: 22R; .Checked SCH: used; Supplier: Digikey; Supplier 1: Digi-Key; Supplier Part Number 1: 311-22.0LRCT-ND; RoHS: RoHS Compliant; Stock 1: 943800; Pricing 1: 10=0.014, 50=0.0104, 100=0.0079, 250=0.00584, 500=0.00432, 1000=0.00288 (USD); Composition: Thick Film; Features: -; Size / Dimension: 0.039" L x 0.020" W (1.00mm x 0.50mm); Height: 0.016" (0.40mm); Number of Terminations: 2; Packaging: Cut Tape (CT); ComponentLink1URL: http://www.yageo.com/documents/recent/PYu-RC0402_51_RoHS_L_6.pdf; ComponentLink1Description: http://www.yageo.com/documents/recent/PYu-RC0402_51_RoHS_L_6.pdf
R99 = ERJ-1GEF1910C: RES 191 OHM 1/20W 1% 0201 SMD; Manufacturer: Panasonic Electronic Components; Resistance (Ohms): 191; Power (Watts): 0.05W, 1/20W; Temperature Coefficient: ±200ppm/°C; .Creator: MM; Supplier 1: Digi-Key; Manufacturer Part Number: ERJ-1GEF1910C; RoHS: RoHS Compliant; Category: Resistors; Stock 1: 34157; Pricing 1: 1=0.11, 50=0.0414, 100=0.0315, 250=0.0234, 500=0.01728, 1000=0.01152, 5000=0.0081 (USD); Packaging: Cut Tape (CT); Tolerance: ±1%; Composition: Thick Film; Features: -; Package / Case: 0201 (0603 Metric); Supplier Device Package: 0201; Size / Dimension: 0.024" L x 0.012" W (0.60mm x 0.30mm); Height: 0.010" (0.26mm); Number of Terminations: 2; ComponentLink1URL: http://media.digikey.com/pdf/Data%20Sheets/Panasonic%20Resistors%20Thermistors%20PDFs/ERJ_G,R,E_Rev08.pdf; ComponentLink1Description: http://media.digikey.com/pdf/Data%20Sheets/Panasonic%20Resistors%20Thermistors%20PDFs/ERJ_G,R,E_Rev08.pdf; Supplier Part Number 1: P191ABCT-ND; .Checked PCB: MM; .Checked SCH: MM
U1 = MCIMX6Q5EYM10AC_v.ORX: as U1 on sheet [05] - CPU - HDMI, LVDS; Supplier 1: Digi-Key; Manufacturer Part Number: MCIMX6Q5EYM10AC; RoHS: RoHS Compliant; Category: Integrated Circuits (ICs); Stock 1: 0; Pricing 1: 1=54.98, 10=51.922, 25=48.868, 100=30.5424 (USD); Packaging: Tray; Package / Case: 624-FBGA, FCBGA; ComponentLink1URL: http://cache.freescale.com/files/32bit/doc/data_sheet/IMX6DQCEC.pdf; ComponentLink1Description: http://cache.freescale.com/files/32bit/doc/data_sheet/IMX6DQCEC.pdf; Supplier Part Number 1: MCIMX6Q5EYM10AC-ND; Program Memory Size: -; EEPROM Size: -; Data Converters: -; Operating Temperature: -20°C ~ 105°C

## Sheet [07] - CPU - CSI, DISP.SchDoc
size A2; DocumentNumber: 7; SheetNumber: 7; SheetTotal: 31
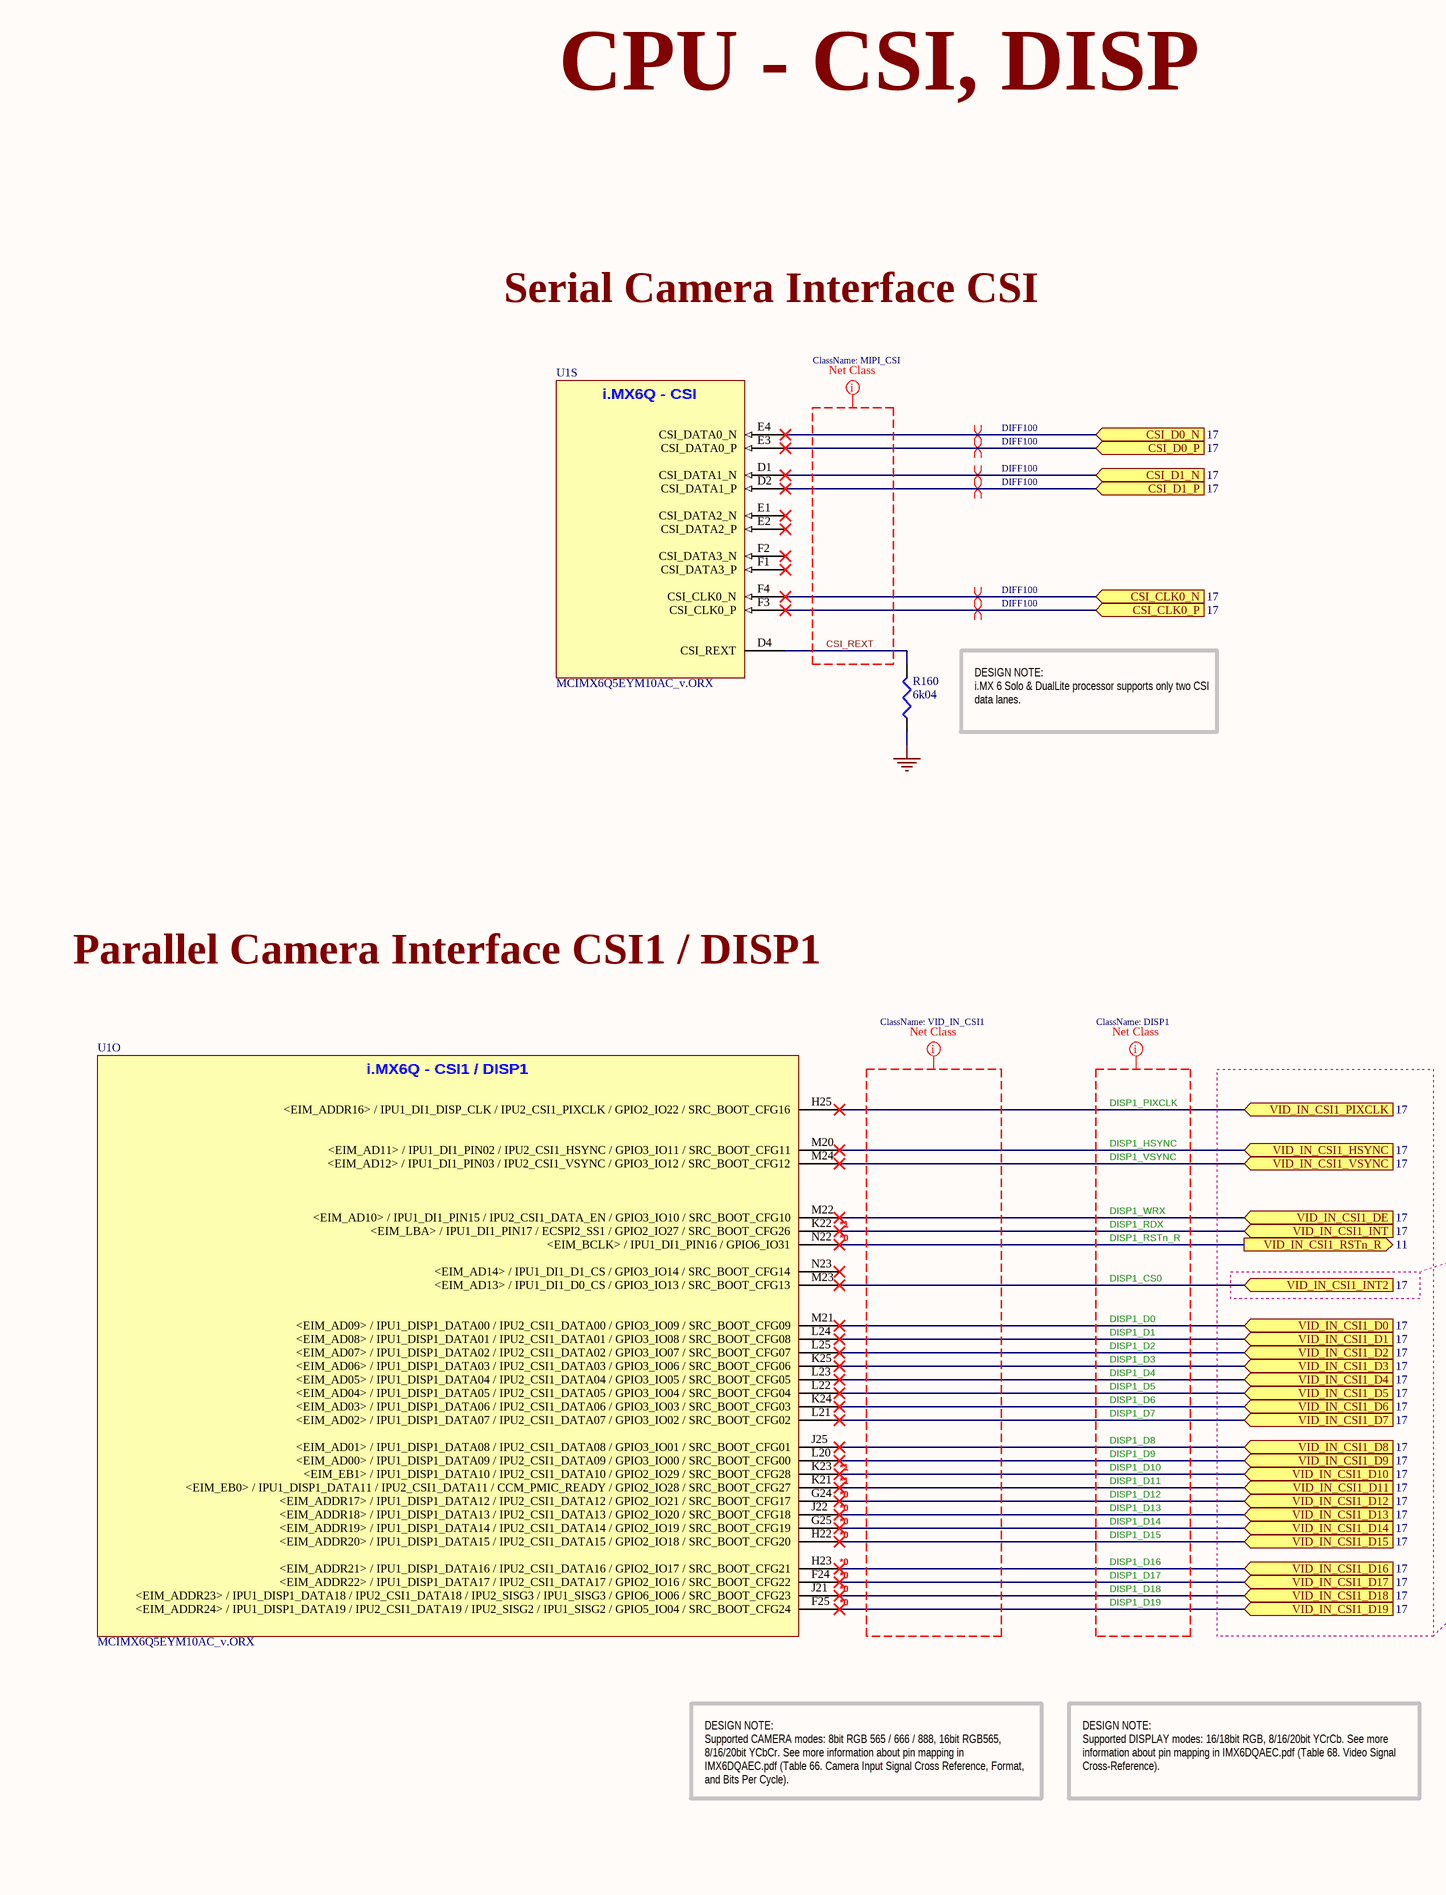
[diagram p8: [07] - CPU - CSI, DISP.SchDoc, left]
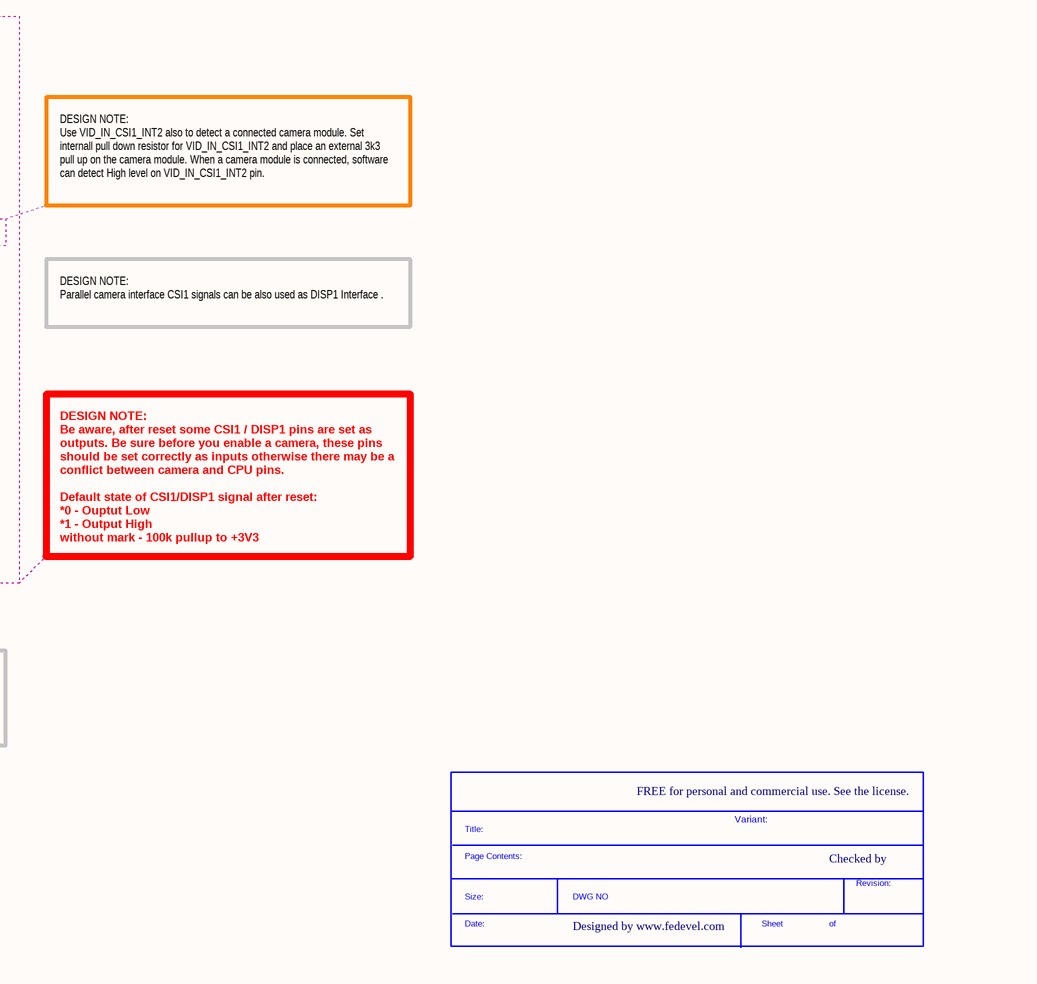
[diagram p9: [07] - CPU - CSI, DISP.SchDoc, right]

### Parts
(Parts that share a designator on the sheet are numbered #1, #2 ... from top to bottom, then left to right.)
*#6  SDTitleBlock  (value not drawn)  (graphical)
R160  6k04  [R0201]
U1  MCIMX6Q5EYM10AC_v.ORX  [PBGA624]  (parts O,S of 21)

### Ports
CSI_CLK0_N (in, see 17), CSI_CLK0_P (in, see 17), CSI_D0_N (in, see 17), CSI_D0_P (in, see 17), CSI_D1_N (in, see 17), CSI_D1_P (in, see 17), VID_IN_CSI1_D0 (in, see 17), VID_IN_CSI1_D1 (in, see 17), VID_IN_CSI1_D2 (in, see 17), VID_IN_CSI1_D3 (in, see 17), VID_IN_CSI1_D4 (in, see 17), VID_IN_CSI1_D5 (in, see 17), VID_IN_CSI1_D6 (in, see 17), VID_IN_CSI1_D7 (in, see 17), VID_IN_CSI1_D8 (in, see 17), VID_IN_CSI1_D9 (in, see 17), VID_IN_CSI1_D10 (in, see 17), VID_IN_CSI1_D11 (in, see 17), VID_IN_CSI1_D12 (in, see 17), VID_IN_CSI1_D13 (in, see 17), VID_IN_CSI1_D14 (in, see 17), VID_IN_CSI1_D15 (in, see 17), VID_IN_CSI1_D16 (in, see 17), VID_IN_CSI1_D17 (in, see 17), VID_IN_CSI1_D18 (in, see 17), VID_IN_CSI1_D19 (in, see 17), VID_IN_CSI1_DE (in, see 17), VID_IN_CSI1_HSYNC (in, see 17), VID_IN_CSI1_INT2 (in, see 17), VID_IN_CSI1_INT (in, see 17), VID_IN_CSI1_PIXCLK (in, see 17), VID_IN_CSI1_RSTn_R (out, see 11), VID_IN_CSI1_VSYNC (in, see 17)

### Nets
GND: R160.1
CSI_CLK0_N: U1.F4(CSI_CLK0_N) ; port CSI_CLK0_N
CSI_CLK0_P: U1.F3(CSI_CLK0_P) ; port CSI_CLK0_P
CSI_D0_N: U1.E4(CSI_DATA0_N) ; port CSI_D0_N
CSI_D0_P: U1.E3(CSI_DATA0_P) ; port CSI_D0_P
CSI_D1_N: U1.D1(CSI_DATA1_N) ; port CSI_D1_N
CSI_D1_P: U1.D2(CSI_DATA1_P) ; port CSI_D1_P
CSI_REXT: R160.2 U1.D4(CSI_REXT)
VID_IN_CSI1_D0: U1.M21(<EIM_AD09>_/_IPU1_DISP1_DATA00_/_IPU2_CSI1_DATA00_/_GPIO3_IO09_/_SRC_BOOT_CFG09) ; port VID_IN_CSI1_D0
VID_IN_CSI1_D1: U1.L24(<EIM_AD08>_/_IPU1_DISP1_DATA01_/_IPU2_CSI1_DATA01_/_GPIO3_IO08_/_SRC_BOOT_CFG08) ; port VID_IN_CSI1_D1
VID_IN_CSI1_D2: U1.L25(<EIM_AD07>_/_IPU1_DISP1_DATA02_/_IPU2_CSI1_DATA02_/_GPIO3_IO07_/_SRC_BOOT_CFG07) ; port VID_IN_CSI1_D2
VID_IN_CSI1_D3: U1.K25(<EIM_AD06>_/_IPU1_DISP1_DATA03_/_IPU2_CSI1_DATA03_/_GPIO3_IO06_/_SRC_BOOT_CFG06) ; port VID_IN_CSI1_D3
VID_IN_CSI1_D4: U1.L23(<EIM_AD05>_/_IPU1_DISP1_DATA04_/_IPU2_CSI1_DATA04_/_GPIO3_IO05_/_SRC_BOOT_CFG05) ; port VID_IN_CSI1_D4
VID_IN_CSI1_D5: U1.L22(<EIM_AD04>_/_IPU1_DISP1_DATA05_/_IPU2_CSI1_DATA05_/_GPIO3_IO04_/_SRC_BOOT_CFG04) ; port VID_IN_CSI1_D5
VID_IN_CSI1_D6: U1.K24(<EIM_AD03>_/_IPU1_DISP1_DATA06_/_IPU2_CSI1_DATA06_/_GPIO3_IO03_/_SRC_BOOT_CFG03) ; port VID_IN_CSI1_D6
VID_IN_CSI1_D7: U1.L21(<EIM_AD02>_/_IPU1_DISP1_DATA07_/_IPU2_CSI1_DATA07_/_GPIO3_IO02_/_SRC_BOOT_CFG02) ; port VID_IN_CSI1_D7
VID_IN_CSI1_D8: U1.J25(<EIM_AD01>_/_IPU1_DISP1_DATA08_/_IPU2_CSI1_DATA08_/_GPIO3_IO01_/_SRC_BOOT_CFG01) ; port VID_IN_CSI1_D8
VID_IN_CSI1_D9: U1.L20(<EIM_AD00>_/_IPU1_DISP1_DATA09_/_IPU2_CSI1_DATA09_/_GPIO3_IO00_/_SRC_BOOT_CFG00) ; port VID_IN_CSI1_D9
VID_IN_CSI1_D10: U1.K23(<EIM_EB1>_/_IPU1_DISP1_DATA10_/_IPU2_CSI1_DATA10_/_GPIO2_IO29_/_SRC_BOOT_CFG28) ; port VID_IN_CSI1_D10
VID_IN_CSI1_D11: U1.K21(<EIM_EB0>_/_IPU1_DISP1_DATA11_/_IPU2_CSI1_DATA11_/_CCM_PMIC_READY_/_GPIO2_IO28_/_SRC_BOOT_CFG27) ; port VID_IN_CSI1_D11
VID_IN_CSI1_D12: U1.G24(<EIM_ADDR17>_/_IPU1_DISP1_DATA12_/_IPU2_CSI1_DATA12_/_GPIO2_IO21_/_SRC_BOOT_CFG17) ; port VID_IN_CSI1_D12
VID_IN_CSI1_D13: U1.J22(<EIM_ADDR18>_/_IPU1_DISP1_DATA13_/_IPU2_CSI1_DATA13_/_GPIO2_IO20_/_SRC_BOOT_CFG18) ; port VID_IN_CSI1_D13
VID_IN_CSI1_D14: U1.G25(<EIM_ADDR19>_/_IPU1_DISP1_DATA14_/_IPU2_CSI1_DATA14_/_GPIO2_IO19_/_SRC_BOOT_CFG19) ; port VID_IN_CSI1_D14
VID_IN_CSI1_D15: U1.H22(<EIM_ADDR20>_/_IPU1_DISP1_DATA15_/_IPU2_CSI1_DATA15_/_GPIO2_IO18_/_SRC_BOOT_CFG20) ; port VID_IN_CSI1_D15
VID_IN_CSI1_D16: U1.H23(<EIM_ADDR21>_/_IPU1_DISP1_DATA16_/_IPU2_CSI1_DATA16_/_GPIO2_IO17_/_SRC_BOOT_CFG21) ; port VID_IN_CSI1_D16
VID_IN_CSI1_D17: U1.F24(<EIM_ADDR22>_/_IPU1_DISP1_DATA17_/_IPU2_CSI1_DATA17_/_GPIO2_IO16_/_SRC_BOOT_CFG22) ; port VID_IN_CSI1_D17
VID_IN_CSI1_D18: U1.J21(<EIM_ADDR23>_/_IPU1_DISP1_DATA18_/_IPU2_CSI1_DATA18_/_IPU2_SISG3_/_IPU1_SISG3_/_GPIO6_IO06_/_SRC_BOOT_CFG23) ; port VID_IN_CSI1_D18
VID_IN_CSI1_D19: U1.F25(<EIM_ADDR24>_/_IPU1_DISP1_DATA19_/_IPU2_CSI1_DATA19_/_IPU2_SISG2_/_IPU1_SISG2_/_GPIO5_IO04_/_SRC_BOOT_CFG24) ; port VID_IN_CSI1_D19
VID_IN_CSI1_DE: U1.M22(<EIM_AD10>_/_IPU1_DI1_PIN15_/_IPU2_CSI1_DATA_EN_/_GPIO3_IO10_/_SRC_BOOT_CFG10) ; port VID_IN_CSI1_DE
VID_IN_CSI1_HSYNC: U1.M20(<EIM_AD11>_/_IPU1_DI1_PIN02_/_IPU2_CSI1_HSYNC_/_GPIO3_IO11_/_SRC_BOOT_CFG11) ; port VID_IN_CSI1_HSYNC
VID_IN_CSI1_INT: U1.K22(<EIM_LBA>_/_IPU1_DI1_PIN17_/_ECSPI2_SS1_/_GPIO2_IO27_/_SRC_BOOT_CFG26) ; port VID_IN_CSI1_INT
VID_IN_CSI1_INT2: U1.M23(<EIM_AD13>_/_IPU1_DI1_D0_CS_/_GPIO3_IO13_/_SRC_BOOT_CFG13) ; port VID_IN_CSI1_INT2
VID_IN_CSI1_PIXCLK: U1.H25(<EIM_ADDR16>_/_IPU1_DI1_DISP_CLK_/_IPU2_CSI1_PIXCLK_/_GPIO2_IO22_/_SRC_BOOT_CFG16) ; port VID_IN_CSI1_PIXCLK
VID_IN_CSI1_RSTn_R: U1.N22(<EIM_BCLK>_/_IPU1_DI1_PIN16_/_GPIO6_IO31) ; port VID_IN_CSI1_RSTn_R
VID_IN_CSI1_VSYNC: U1.M24(<EIM_AD12>_/_IPU1_DI1_PIN03_/_IPU2_CSI1_VSYNC_/_GPIO3_IO12_/_SRC_BOOT_CFG12) ; port VID_IN_CSI1_VSYNC

Not connected (* = marked no-connect by the designer): U1 E1(CSI_DATA2_N)* E2(CSI_DATA2_P)* F1(CSI_DATA3_P)* F2(CSI_DATA3_N)* N23(<EIM_AD14>_/_IPU1_DI1_D1_CS_/_GPIO3_IO14_/_SRC_BOOT_CFG14)*

### Layout directives
net class DISP1: (no net found under the mark)
net class VID_IN_CSI1: (no net found under the mark)
differential pair; net class DIFF100: CSI_CLK0_N, CSI_CLK0_P, CSI_D0_N, CSI_D0_P, CSI_D1_N, CSI_D1_P
net class MIPI_CSI: CSI_REXT

### Notes on the sheet
- CPU - CSI, DISP
- Serial Camera Interface CSI
- DESIGN NOTE:
  i.MX 6 Solo & DualLite processor supports only two CSI data lanes.
- Parallel Camera Interface CSI1 / DISP1
- DISP1_PIXCLK
- DISP1_HSYNC
- DISP1_VSYNC
- (near U1) *1
- (near U1) *0
- DISP1_RDX
- DISP1_WRX
- DISP1_RSTn_R
- DESIGN NOTE:
  Use VID_IN_CSI1_INT2 also to detect a connected camera module. Set internall pull down resistor for VID_IN_CSI1_INT2 and place an external 3k3 pull up on the camera module. When a camera module is connected, software can detect High level on VID_IN_CSI1_INT2 pin.
- DISP1_D0
- DISP1_CS0
- DISP1_D1
- DISP1_D2
- DISP1_D3
- DISP1_D4
- DISP1_D5
- DESIGN NOTE:
  Parallel camera interface CSI1 signals can be also used as DISP1 Interface .
- DISP1_D6
- DISP1_D7
- DISP1_D8
- DISP1_D9
- DISP1_D10
- DISP1_D11
- DISP1_D12
- DISP1_D13
- DISP1_D14
- DISP1_D15
- DISP1_D16
- DISP1_D17
- DISP1_D18
- DISP1_D19
- DESIGN NOTE:
  Be aware, after reset some CSI1 / DISP1 pins are set as outputs. Be sure before you enable a camera, these pins should be set correctly as inputs otherwise there may be a conflict between camera and CPU pins.
  Default state of CSI1/DISP1 signal after reset:
  *0 - Ouptut Low
  *1 - Output High
  without mark - 100k pullup to +3V3
- DESIGN NOTE:
  Supported CAMERA modes: 8bit RGB 565 / 666 / 888, 16bit RGB565, 8/16/20bit YCbCr. See more information about pin mapping in IMX6DQAEC.pdf (Table 66. Camera Input Signal Cross Reference, Format, and Bits Per Cycle).
- DESIGN NOTE:
  Supported DISPLAY modes: 16/18bit RGB, 8/16/20bit YCrCb. See more information about pin mapping in IMX6DQAEC.pdf (Table 68. Video Signal Cross-Reference).
- FREE for personal and commercial use. See the license.
- Variant:
- Checked by
- Designed by www.fedevel.com
- (in symbol MCIMX6Q5EYM10AC_v.ORX, part O) i.MX6Q - CSI1 / DISP1
- (in symbol MCIMX6Q5EYM10AC_v.ORX, part S) i.MX6Q - CSI
- (in symbol SDTitleBlock) Title:; Page Contents:; Revision:; Size:; DWG NO; Date:; Sheet; of

### Library data of the parts
R160 = ERJ-1GEF6041C: RES 6.04K OHM 1/20W 1% 0201 SMD; Manufacturer: Panasonic Electronic Components; Power (Watts): 0.05W, 1/20W; Temperature Coefficient: ±200ppm/°C; .Creator: MM; Supplier 1: Digi-Key; Manufacturer Part Number: ERJ-1GEF6041C; RoHS: RoHS Compliant; Category: Resistors; Stock 1: 78155; Pricing 1: 1=0.11, 50=0.0414, 100=0.0315, 250=0.0234, 500=0.01728, 1000=0.01152, 5000=0.0081 (USD); Packaging: Cut Tape (CT); Resistance (Ohms): 6.04k; Tolerance: ±1%; Composition: Thick Film; Features: -; Package / Case: 0201 (0603 Metric); Supplier Device Package: 0201; Size / Dimension: 0.024" L x 0.012" W (0.60mm x 0.30mm); Height: 0.010" (0.26mm); Number of Terminations: 2; ComponentLink1URL: http://media.digikey.com/pdf/Data%20Sheets/Panasonic%20Resistors%20Thermistors%20PDFs/ERJ_G,R,E_Rev08.pdf; ComponentLink1Description: http://media.digikey.com/pdf/Data%20Sheets/Panasonic%20Resistors%20Thermistors%20PDFs/ERJ_G,R,E_Rev08.pdf; Supplier Part Number 1: P6.04KABCT-ND; .Checked PCB: MM; .Checked SCH: MM
U1 = MCIMX6Q5EYM10AC_v.ORX: as U1 on sheet [03] - CPU - DDR3, DDR3 MEM; Supplier 1: Digi-Key; Manufacturer Part Number: MCIMX6Q5EYM10AC; RoHS: RoHS Compliant; Category: Integrated Circuits (ICs); Stock 1: 0; Pricing 1: 1=54.98, 10=51.922, 25=48.868, 100=30.5424 (USD); Program Memory Size: -; EEPROM Size: -; Data Converters: -; Operating Temperature: -20°C ~ 105°C; Package / Case: 624-FBGA, FCBGA; Packaging: Tray; ComponentLink1URL: http://cache.freescale.com/files/32bit/doc/data_sheet/IMX6DQCEC.pdf; ComponentLink1Description: http://cache.freescale.com/files/32bit/doc/data_sheet/IMX6DQCEC.pdf; Supplier Part Number 1: MCIMX6Q5EYM10AC-ND

## Sheet [08] - CPU - SPI, UART.SchDoc
size A2; DocumentNumber: 8; SheetNumber: 8; SheetTotal: 31
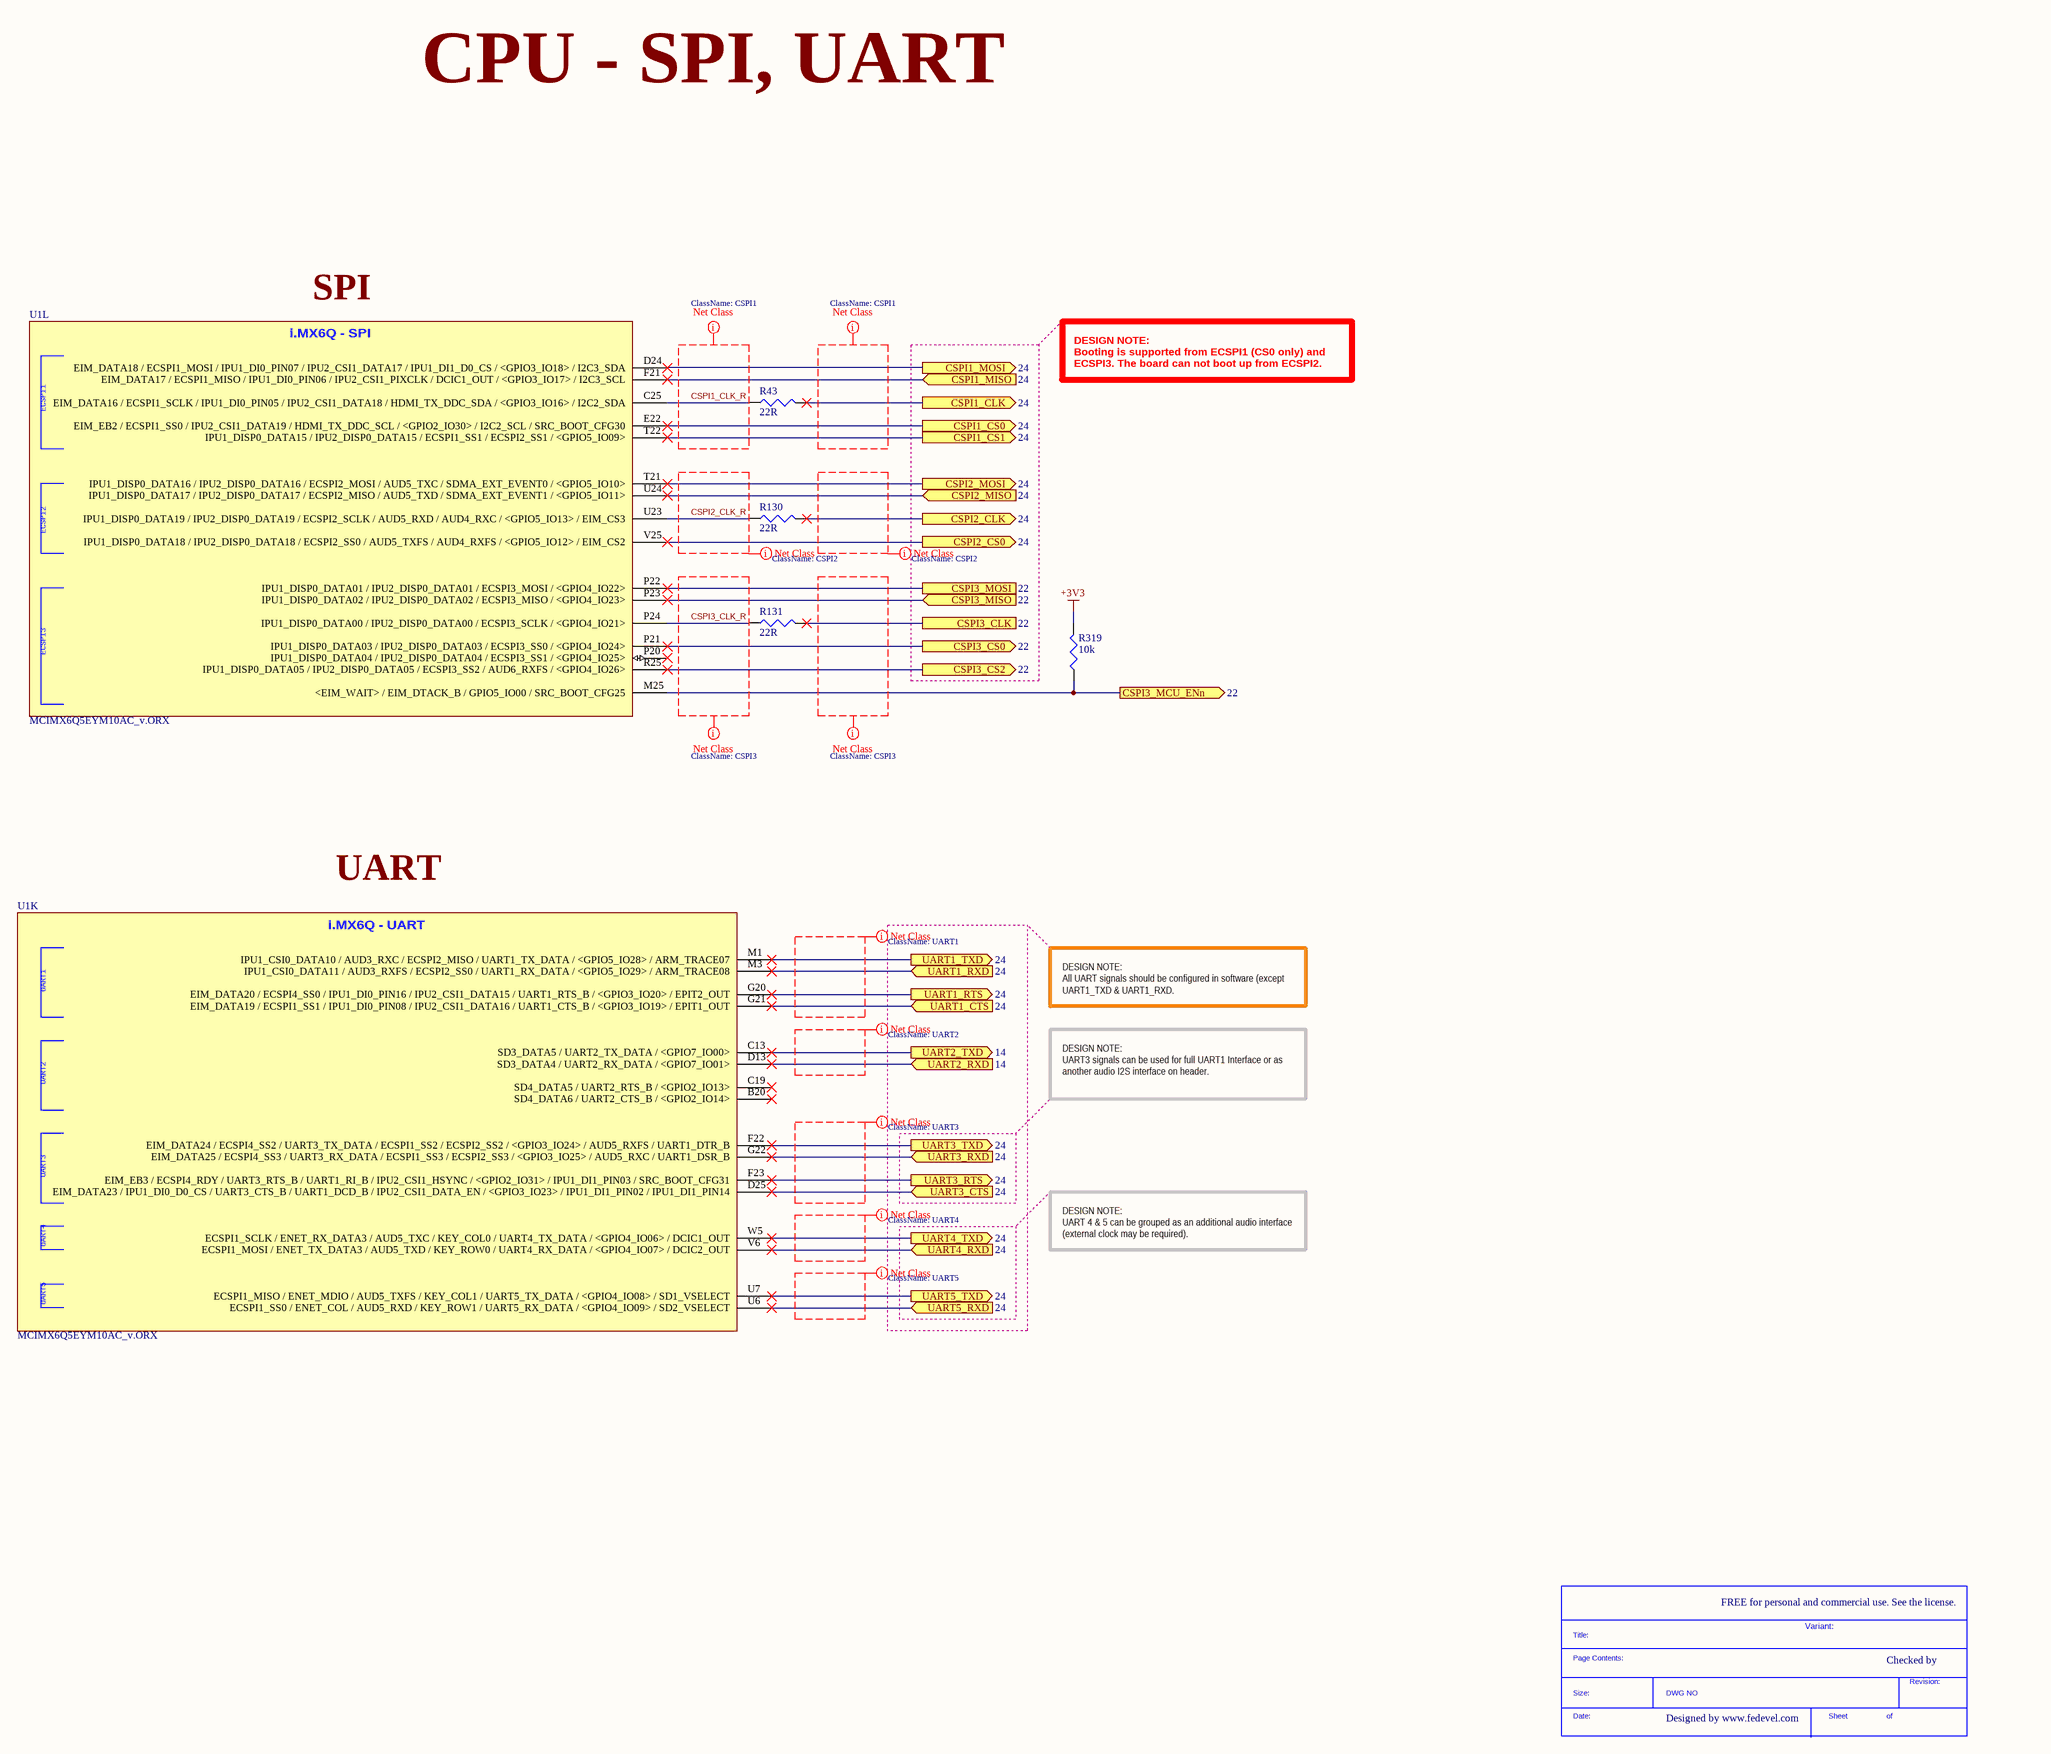
[diagram p10: [08] - CPU - SPI, UART.SchDoc]

### Parts
(Parts that share a designator on the sheet are numbered #1, #2 ... from top to bottom, then left to right.)
*#7  SDTitleBlock  (value not drawn)  (graphical)
R43  22R  [R0402]
R130  22R  [R0402]
R131  22R  [R0402]
R319  10k  [R0402]
U1  MCIMX6Q5EYM10AC_v.ORX  [PBGA624]  (parts K,L of 21)

### Ports
CSPI1_CLK (out, see 24), CSPI1_CS0 (out, see 24), CSPI1_CS1 (out, see 24), CSPI1_MISO (in, see 24), CSPI1_MOSI (out, see 24), CSPI2_CLK (out, see 24), CSPI2_CS0 (out, see 24), CSPI2_MISO (in, see 24), CSPI2_MOSI (out, see 24), CSPI3_CLK (see 22), CSPI3_CS0 (out, see 22), CSPI3_CS2 (out, see 22), CSPI3_MCU_ENn (out, see 22), CSPI3_MISO (in, see 22), CSPI3_MOSI (see 22), UART1_CTS (in, see 24), UART1_RTS (out, see 24), UART1_RXD (in, see 24), UART1_TXD (out, see 24), UART2_RXD (in, see 14), UART2_TXD (out, see 14), UART3_CTS (in, see 24), UART3_RTS (out, see 24), UART3_RXD (in, see 24), UART3_TXD (out, see 24), UART4_RXD (in, see 24), UART4_TXD (out, see 24), UART5_RXD (in, see 24), UART5_TXD (out, see 24)

### Nets
+3V3: R319.2
CSPI1_CLK: R43.2 ; port CSPI1_CLK
CSPI1_CLK_R: R43.1 U1.C25(EIM_DATA16_/_ECSPI1_SCLK_/_IPU1_DI0_PIN05_/_IPU2_CSI1_DATA18_/_HDMI_TX_DDC_SDA_/_<GPIO3_IO16>_/_I2C2_SDA)
CSPI1_CS0: U1.E22(EIM_EB2_/_ECSPI1_SS0_/_IPU2_CSI1_DATA19_/_HDMI_TX_DDC_SCL_/_<GPIO2_IO30>_/_I2C2_SCL_/_SRC_BOOT_CFG30) ; port CSPI1_CS0
CSPI1_CS1: U1.T22(IPU1_DISP0_DATA15_/_IPU2_DISP0_DATA15_/_ECSPI1_SS1_/_ECSPI2_SS1_/_<GPIO5_IO09>) ; port CSPI1_CS1
CSPI1_MISO: U1.F21(EIM_DATA17_/_ECSPI1_MISO_/_IPU1_DI0_PIN06_/_IPU2_CSI1_PIXCLK_/_DCIC1_OUT_/_<GPIO3_IO17>_/_I2C3_SCL) ; port CSPI1_MISO
CSPI1_MOSI: U1.D24(EIM_DATA18_/_ECSPI1_MOSI_/_IPU1_DI0_PIN07_/_IPU2_CSI1_DATA17_/_IPU1_DI1_D0_CS_/_<GPIO3_IO18>_/_I2C3_SDA) ; port CSPI1_MOSI
CSPI2_CLK: R130.2 ; port CSPI2_CLK
CSPI2_CLK_R: R130.1 U1.U23(IPU1_DISP0_DATA19_/_IPU2_DISP0_DATA19_/_ECSPI2_SCLK_/_AUD5_RXD_/_AUD4_RXC_/_<GPIO5_IO13>_/_EIM_CS3)
CSPI2_CS0: U1.V25(IPU1_DISP0_DATA18_/_IPU2_DISP0_DATA18_/_ECSPI2_SS0_/_AUD5_TXFS_/_AUD4_RXFS_/_<GPIO5_IO12>_/_EIM_CS2) ; port CSPI2_CS0
CSPI2_MISO: U1.U24(IPU1_DISP0_DATA17_/_IPU2_DISP0_DATA17_/_ECSPI2_MISO_/_AUD5_TXD_/_SDMA_EXT_EVENT1_/_<GPIO5_IO11>) ; port CSPI2_MISO
CSPI2_MOSI: U1.T21(IPU1_DISP0_DATA16_/_IPU2_DISP0_DATA16_/_ECSPI2_MOSI_/_AUD5_TXC_/_SDMA_EXT_EVENT0_/_<GPIO5_IO10>) ; port CSPI2_MOSI
CSPI3_CLK: R131.2 ; port CSPI3_CLK
CSPI3_CLK_R: R131.1 U1.P24(IPU1_DISP0_DATA00_/_IPU2_DISP0_DATA00_/_ECSPI3_SCLK_/_<GPIO4_IO21>)
CSPI3_CS0: U1.P21(IPU1_DISP0_DATA03_/_IPU2_DISP0_DATA03_/_ECSPI3_SS0_/_<GPIO4_IO24>) ; port CSPI3_CS0
CSPI3_CS2: U1.R25(IPU1_DISP0_DATA05_/_IPU2_DISP0_DATA05_/_ECSPI3_SS2_/_AUD6_RXFS_/_<GPIO4_IO26>) ; port CSPI3_CS2
CSPI3_MCU_ENn: R319.1 U1.M25(<EIM_WAIT>_/_EIM_DTACK_B_/_GPIO5_IO00_/_SRC_BOOT_CFG25) ; port CSPI3_MCU_ENn
CSPI3_MISO: U1.P23(IPU1_DISP0_DATA02_/_IPU2_DISP0_DATA02_/_ECSPI3_MISO_/_<GPIO4_IO23>) ; port CSPI3_MISO
CSPI3_MOSI: U1.P22(IPU1_DISP0_DATA01_/_IPU2_DISP0_DATA01_/_ECSPI3_MOSI_/_<GPIO4_IO22>) ; port CSPI3_MOSI
UART1_CTS: U1.G21(EIM_DATA19_/_ECSPI1_SS1_/_IPU1_DI0_PIN08_/_IPU2_CSI1_DATA16_/_UART1_CTS_B_/_<GPIO3_IO19>_/_EPIT1_OUT) ; port UART1_CTS
UART1_RTS: U1.G20(EIM_DATA20_/_ECSPI4_SS0_/_IPU1_DI0_PIN16_/_IPU2_CSI1_DATA15_/_UART1_RTS_B_/_<GPIO3_IO20>_/_EPIT2_OUT) ; port UART1_RTS
UART1_RXD: U1.M3(IPU1_CSI0_DATA11_/_AUD3_RXFS_/_ECSPI2_SS0_/_UART1_RX_DATA_/_<GPIO5_IO29>_/_ARM_TRACE08) ; port UART1_RXD
UART1_TXD: U1.M1(IPU1_CSI0_DATA10_/_AUD3_RXC_/_ECSPI2_MISO_/_UART1_TX_DATA_/_<GPIO5_IO28>_/_ARM_TRACE07) ; port UART1_TXD
UART2_RXD: U1.D13(SD3_DATA4_/_UART2_RX_DATA_/_<GPIO7_IO01>) ; port UART2_RXD
UART2_TXD: U1.C13(SD3_DATA5_/_UART2_TX_DATA_/_<GPIO7_IO00>) ; port UART2_TXD
UART3_CTS: U1.D25(EIM_DATA23_/_IPU1_DI0_D0_CS_/_UART3_CTS_B_/_UART1_DCD_B_/_IPU2_CSI1_DATA_EN_/_<GPIO3_IO23>_/_IPU1_DI1_PIN02_/_IPU1_DI1_PIN14) ; port UART3_CTS
UART3_RTS: U1.F23(EIM_EB3_/_ECSPI4_RDY_/_UART3_RTS_B_/_UART1_RI_B_/_IPU2_CSI1_HSYNC_/_<GPIO2_IO31>_/_IPU1_DI1_PIN03_/_SRC_BOOT_CFG31) ; port UART3_RTS
UART3_RXD: U1.G22(EIM_DATA25_/_ECSPI4_SS3_/_UART3_RX_DATA_/_ECSPI1_SS3_/_ECSPI2_SS3_/_<GPIO3_IO25>_/_AUD5_RXC_/_UART1_DSR_B) ; port UART3_RXD
UART3_TXD: U1.F22(EIM_DATA24_/_ECSPI4_SS2_/_UART3_TX_DATA_/_ECSPI1_SS2_/_ECSPI2_SS2_/_<GPIO3_IO24>_/_AUD5_RXFS_/_UART1_DTR_B) ; port UART3_TXD
UART4_RXD: U1.V6(ECSPI1_MOSI_/_ENET_TX_DATA3_/_AUD5_TXD_/_KEY_ROW0_/_UART4_RX_DATA_/_<GPIO4_IO07>_/_DCIC2_OUT) ; port UART4_RXD
UART4_TXD: U1.W5(ECSPI1_SCLK_/_ENET_RX_DATA3_/_AUD5_TXC_/_KEY_COL0_/_UART4_TX_DATA_/_<GPIO4_IO06>_/_DCIC1_OUT) ; port UART4_TXD
UART5_RXD: U1.U6(ECSPI1_SS0_/_ENET_COL_/_AUD5_RXD_/_KEY_ROW1_/_UART5_RX_DATA_/_<GPIO4_IO09>_/_SD2_VSELECT) ; port UART5_RXD
UART5_TXD: U1.U7(ECSPI1_MISO_/_ENET_MDIO_/_AUD5_TXFS_/_KEY_COL1_/_UART5_TX_DATA_/_<GPIO4_IO08>_/_SD1_VSELECT) ; port UART5_TXD

Not connected (* = marked no-connect by the designer): U1 B20(SD4_DATA6_/_UART2_CTS_B_/_<GPIO2_IO14>)* C19(SD4_DATA5_/_UART2_RTS_B_/_<GPIO2_IO13>)* P20(IPU1_DISP0_DATA04_/_IPU2_DISP0_DATA04_/_ECSPI3_SS1_/_<GPIO4_IO25>)*

### Layout directives
net class UART1: (no net found under the mark)
net class CSPI1: (no net found under the mark), CSPI1_CLK_R
net class CSPI3: (no net found under the mark), CSPI3_CLK_R
net class UART3: (no net found under the mark)
net class CSPI2: (no net found under the mark), CSPI2_CLK_R
net class UART4: (no net found under the mark)
net class UART5: (no net found under the mark)
net class UART2: (no net found under the mark)

### Notes on the sheet
- CPU - SPI, UART
- SPI
- DESIGN NOTE:
  Booting is supported from ECSPI1 (CS0 only) and ECSPI3. The board can not boot up from ECSPI2.
- UART
- DESIGN NOTE:
  All UART signals should be configured in software (except UART1_TXD & UART1_RXD.
- DESIGN NOTE:
  UART3 signals can be used for full UART1 Interface or as another audio I2S interface on header.
- DESIGN NOTE:
  UART 4 & 5 can be grouped as an additional audio interface (external clock may be required).
- FREE for personal and commercial use. See the license.
- Variant:
- Checked by
- Designed by www.fedevel.com
- (in symbol MCIMX6Q5EYM10AC_v.ORX, part K) i.MX6Q - UART; UART1; UART2; UART3; UART4; UART5
- (in symbol MCIMX6Q5EYM10AC_v.ORX, part L) i.MX6Q - SPI; ECSPI1; ECSPI2; ECSPI3
- (in symbol SDTitleBlock) Title:; Page Contents:; Revision:; Size:; DWG NO; Date:; Sheet; of

### Library data of the parts
R43 R130 R131 = RC0402FR-0722RL: RES 22.0 OHM 1/16W 1% 0402 SMD; Manufacturer: Yageo; Resistance (Ohms): 22; Power (Watts): 0.063W, 1/16W; .Checked PCB: used; Temperature Coefficient: ±100ppm/°C; Category: Resistors; Supplier Part Number: 311-22.0LRCT-ND; Manufacturer Part Number: RC0402FR-0722RL; Package / Case: 0402 (1005 Metric); Price 1k [$]: 0.01421; Tolerance: ±1%; Value: 22R; .Checked SCH: used; Supplier: Digikey; Supplier 1: Digi-Key; Supplier Part Number 1: 311-22.0LRCT-ND; RoHS: RoHS Compliant; Stock 1: 943800; Pricing 1: 10=0.014, 50=0.0104, 100=0.0079, 250=0.00584, 500=0.00432, 1000=0.00288 (USD); Composition: Thick Film; Features: -; Size / Dimension: 0.039" L x 0.020" W (1.00mm x 0.50mm); Height: 0.016" (0.40mm); Number of Terminations: 2; Packaging: Cut Tape (CT); ComponentLink1URL: http://www.yageo.com/documents/recent/PYu-RC0402_51_RoHS_L_6.pdf; ComponentLink1Description: http://www.yageo.com/documents/recent/PYu-RC0402_51_RoHS_L_6.pdf
R319 = RC0402FR-0710KL: RES 10.0K OHM 1/16W 1% 0402 SMD; Manufacturer: Yageo; Power (Watts): 0.063W, 1/16W; .Checked PCB: used; Temperature Coefficient: ±100ppm/°C; Category: Resistors; Supplier Part Number: 311-10.0KLRCT-ND; Manufacturer Part Number: RC0402FR-0710KL; Package / Case: 0402 (1005 Metric); Price 1k [$]: 0.01421; Resistance (Ohms): 10K; Tolerance: ±1%; Value: 10k; .Checked SCH: used; Supplier: Digikey; Supplier 1: Digi-Key; Supplier Part Number 1: 311-10.0KLRCT-ND; RoHS: RoHS Compliant; Stock 1: 2916495; Pricing 1: 10=0.014, 50=0.0104, 100=0.0079, 250=0.00584, 500=0.00432, 1000=0.00288 (USD); Composition: Thick Film; Features: -; Size / Dimension: 0.039" L x 0.020" W (1.00mm x 0.50mm); Height: 0.016" (0.40mm); Number of Terminations: 2; Packaging: Cut Tape (CT); ComponentLink1URL: http://www.yageo.com/documents/recent/PYu-RC0402_51_RoHS_L_6.pdf; ComponentLink1Description: http://www.yageo.com/documents/recent/PYu-RC0402_51_RoHS_L_6.pdf
U1 = MCIMX6Q5EYM10AC_v.ORX: IC MCU 32BIT ARM QUAD 624FCBGA; Manufacturer: Freescale Semiconductor; Core Processor: ARM® Cortex™-A9; Core Size: 32-Bit Quad-Core; Speed: 1.0GHz; Connectivity: CAN, EBI/EMI, ESAI, Ethernet, GPMI, I2C, MMC/SD, PCI, SATA, SPI, UART, USB, USB OTG; Peripherals: DMA, HDMI, I2S/SSI/AC97, MIPI CSI, MIMI DSI, MIPI HIS, PWM, WDT; Number of I /O: 224; Program Memory Type: External Program Memory; RAM Size: 256K x 8; Voltage - Supply (Vcc/Vdd): 0.925 V ~ 1.5 V; Oscillator Type: Internal; .Creator: MM; .Checked PCB: MM, checked by RF; Supplier 1: Digi-Key; Manufacturer Part Number: MCIMX6Q5EYM10AC; RoHS: RoHS Compliant; Category: Integrated Circuits (ICs); Stock 1: 0; Pricing 1: 1=54.98, 10=51.922, 25=48.868, 100=30.5424 (USD); Program Memory Size: -; EEPROM Size: -; Data Converters: -; Operating Temperature: -20°C ~ 105°C; Package / Case: 624-FBGA, FCBGA; Packaging: Tray; ComponentLink1URL: http://cache.freescale.com/files/32bit/doc/data_sheet/IMX6DQCEC.pdf; ComponentLink1Description: http://cache.freescale.com/files/32bit/doc/data_sheet/IMX6DQCEC.pdf; Supplier Part Number 1: MCIMX6Q5EYM10AC-ND